# EasyEDA Pro project EasyEda.epro, board Left Hand
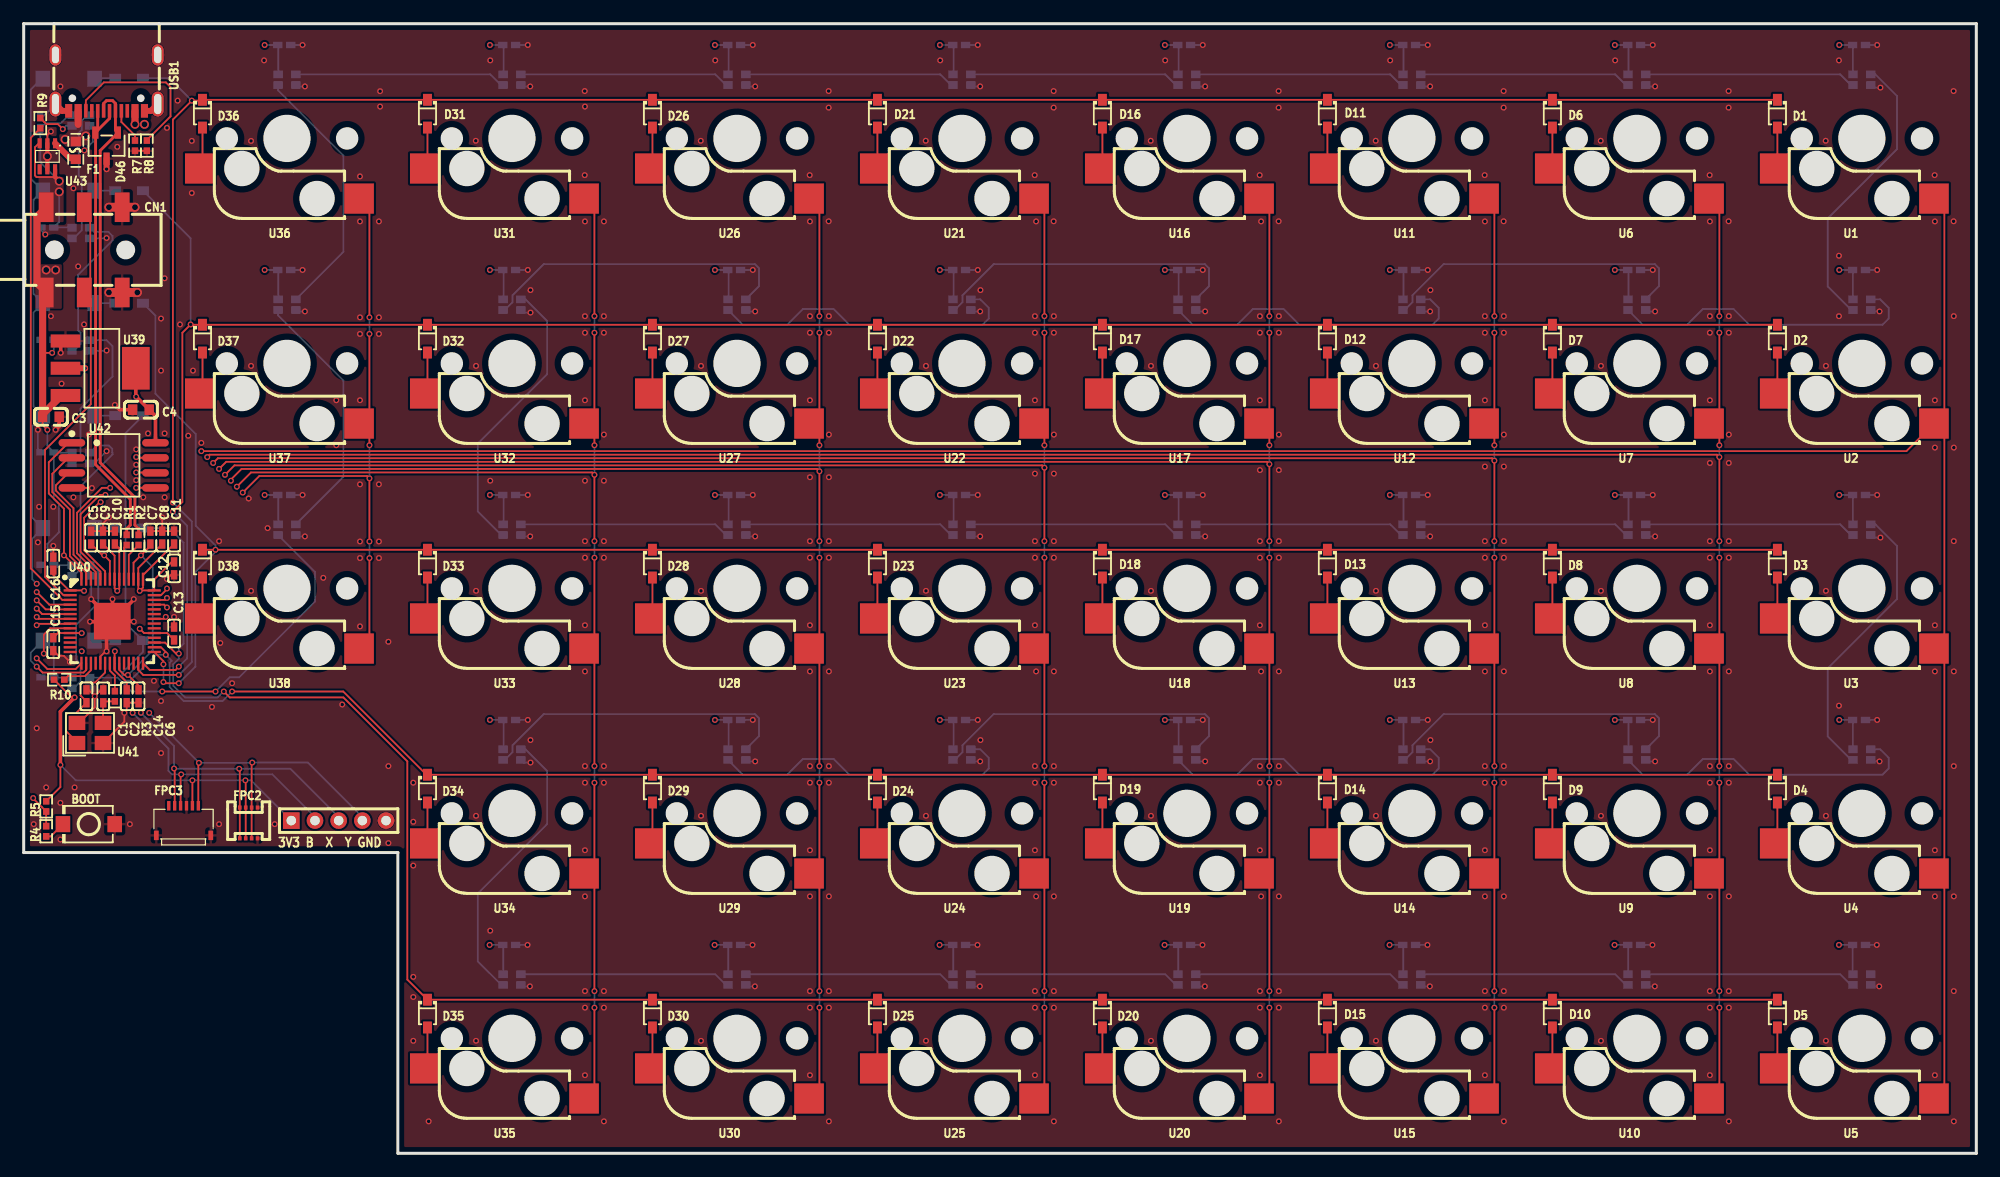
[diagram p5: board, top side]
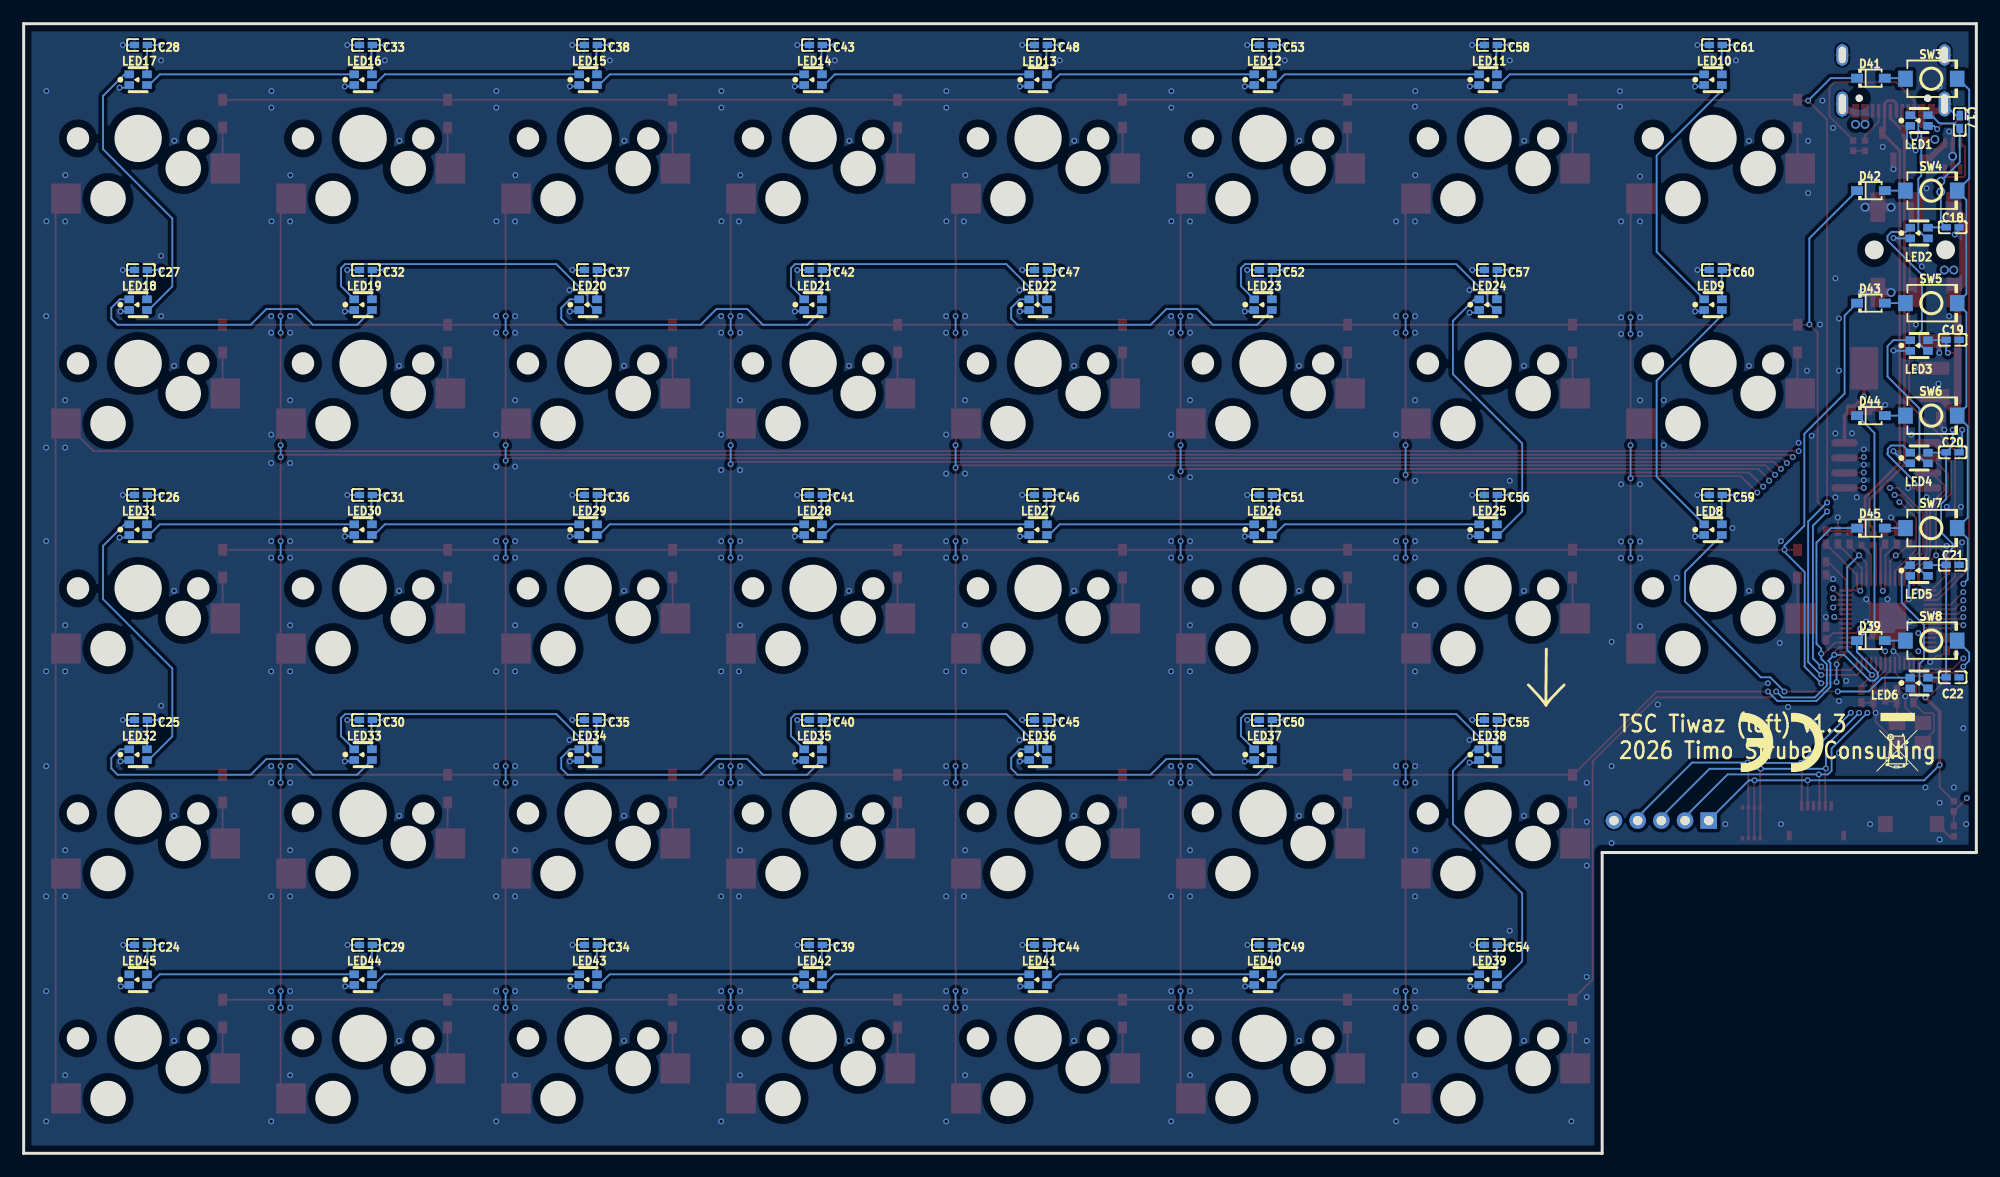
[diagram p6: board, bottom side, seen from below]

Outline 164.9 x 95.4 mm; copper layers: Top Layer, Inner1, Inner2, Bottom Layer. Coordinates in mm from the lower left corner of the outline.
Outline path: 0,95.4 0,25.4 31.6,25.4 31.6,0 164.9,0 164.9,95.4 0,95.4
Stack: Top Layer 0.035mm Outer layer thickness 1oz / Dielectric1 0.2104mm 7628 RC49% 8.6mil / Inner1 0.0152mm Inner layer thickness / Dielectric2 1.065mm 1.1mm H/HOZ Copper / Inner2 0.0152mm Inner layer thickness / Dielectric3 0.2104mm 7628 RC49% 8.6mil / Bottom Layer 0.035mm Outer layer thickness 1oz

## Design rules (mm)
template: User Custom Config
spacing Default (default): track to track 0.15, other pairs 0 to 1
track width Default (default): min 0.15, default 0.15, max 25.4
differential pair differentialPair (default): width min 0.127, default 0.254, max 2.54; gap min 0.152, default 0.152
differential pair USB 12Mbps: width min 0.24, default 0.24, max 0.24; gap min 0.15, default 0.15
via Default (default): diameter min 0.5, default 0.5, max 100.025; hole min 0.3, default 0.3, max 59.995
net $1I33712\VBUS uses Full
pour e92 uses Full
pour e10568 uses Full
pour e31061 uses PWR

## Placement (name value [footprint] x y rotation side)
BOOT  TS-1088-AR02016  [SW-SMD_L3.9-W3.0-P4.45]  5.5 27.8 180 top
C1  15pF  [C0402]  5.3 38.6 90 top
C2  15pF  [C0402]  6.72 38.59 270 top
C3  10uF  [C0603]  2.3 62.2 180 top
C4  10uF  [C0603]  9.9 62.8 0 top
C5  100nF  [C0402]  5.7 52 270 top
C6  100nF  [C0402]  9.7 38.6 90 top
C7  1uF  [C0402]  10.7 52 270 top
C8  1uF  [C0402]  11.7 52 90 top
C9  100nF  [C0402]  6.7 52 270 top
C10  100nF  [C0402]  7.7 52 270 top
C11  100nF  [C0402]  12.7 52 270 top
C12  100nF  [C0402]  12.7 49.4 90 top
C13  100nF  [C0402]  12.7 43.9 270 top
C14  100nF  [C0402]  8.7 38.6 90 top
C15  100nF  [C0402]  2.5 43 90 top
C16  100nF  [C0402]  2.5 49.8 270 top
C17  100nF  [C0402]  1.4 87.1 270 bottom
C18  100nF  [C0402]  2 78.2 0 bottom
C19  100nF  [C0402]  2 68.7 0 bottom
C20  100nF  [C0402]  2 59.2 0 bottom
C21  100nF  [C0402]  2 49.7 0 bottom
C22  100nF  [C0402]  2 40.2 0 bottom
C24  100nF  [C0402]  155 17.6 180 bottom
C25  100nF  [C0402]  155 36.6 180 bottom
C26  100nF  [C0402]  155 55.6 180 bottom
C27  100nF  [C0402]  155 74.6 180 bottom
C28  100nF  [C0402]  155 93.6 180 bottom
C29  100nF  [C0402]  136 17.6 180 bottom
C30  100nF  [C0402]  136 36.6 180 bottom
C31  100nF  [C0402]  136 55.6 180 bottom
C32  100nF  [C0402]  136 74.6 180 bottom
C33  100nF  [C0402]  136 93.6 180 bottom
C34  100nF  [C0402]  117 17.6 180 bottom
C35  100nF  [C0402]  117 36.6 180 bottom
C36  100nF  [C0402]  117 55.6 180 bottom
C37  100nF  [C0402]  117 74.6 180 bottom
C38  100nF  [C0402]  117 93.6 180 bottom
C39  100nF  [C0402]  98 17.6 180 bottom
C40  100nF  [C0402]  98 36.6 180 bottom
C41  100nF  [C0402]  98 55.6 180 bottom
C42  100nF  [C0402]  98 74.6 180 bottom
C43  100nF  [C0402]  98 93.6 180 bottom
C44  100nF  [C0402]  79 17.6 180 bottom
C45  100nF  [C0402]  79 36.6 180 bottom
C46  100nF  [C0402]  79 55.6 180 bottom
C47  100nF  [C0402]  79 74.6 180 bottom
C48  100nF  [C0402]  79 93.6 180 bottom
C49  100nF  [C0402]  60 17.6 180 bottom
C50  100nF  [C0402]  60 36.6 180 bottom
C51  100nF  [C0402]  60 55.6 180 bottom
C52  100nF  [C0402]  60 74.6 180 bottom
C53  100nF  [C0402]  60 93.6 180 bottom
C54  100nF  [C0402]  41 17.6 180 bottom
C55  100nF  [C0402]  41 36.6 180 bottom
C56  100nF  [C0402]  41 55.6 180 bottom
C57  100nF  [C0402]  41 74.6 180 bottom
C58  100nF  [C0402]  41 93.6 180 bottom
C59  100nF  [C0402]  22 55.6 180 bottom
C60  100nF  [C0402]  22 74.6 180 bottom
C61  100nF  [C0402]  22 93.6 180 bottom
CN1  PJ-313D  [AUDIO-SMD_PJ-313D-2]  5.11 76.3 90 top
D1  1N4148WS  [SOD-323_L1.8-W1.3-LS2.5-RD]  148.1 87.8 270 top
D2  1N4148WS  [SOD-323_L1.8-W1.3-LS2.5-RD]  148.1 68.8 270 top
D3  1N4148WS  [SOD-323_L1.8-W1.3-LS2.5-RD]  148.1 49.8 270 top
D4  1N4148WS  [SOD-323_L1.8-W1.3-LS2.5-RD]  148.1 30.8 270 top
D5  1N4148WS  [SOD-323_L1.8-W1.3-LS2.5-RD]  148.1 11.8 270 top
D6  1N4148WS  [SOD-323_L1.8-W1.3-LS2.5-RD]  129.1 87.8 270 top
D7  1N4148WS  [SOD-323_L1.8-W1.3-LS2.5-RD]  129.1 68.8 270 top
D8  1N4148WS  [SOD-323_L1.8-W1.3-LS2.5-RD]  129.1 49.8 270 top
D9  1N4148WS  [SOD-323_L1.8-W1.3-LS2.5-RD]  129.1 30.8 270 top
D10  1N4148WS  [SOD-323_L1.8-W1.3-LS2.5-RD]  129.1 11.8 270 top
D11  1N4148WS  [SOD-323_L1.8-W1.3-LS2.5-RD]  110.1 87.8 270 top
D12  1N4148WS  [SOD-323_L1.8-W1.3-LS2.5-RD]  110.1 68.8 270 top
D13  1N4148WS  [SOD-323_L1.8-W1.3-LS2.5-RD]  110.1 49.8 270 top
D14  1N4148WS  [SOD-323_L1.8-W1.3-LS2.5-RD]  110.1 30.8 270 top
D15  1N4148WS  [SOD-323_L1.8-W1.3-LS2.5-RD]  110.1 11.8 270 top
D16  1N4148WS  [SOD-323_L1.8-W1.3-LS2.5-RD]  91.1 87.8 270 top
D17  1N4148WS  [SOD-323_L1.8-W1.3-LS2.5-RD]  91.1 68.8 270 top
D18  1N4148WS  [SOD-323_L1.8-W1.3-LS2.5-RD]  91.1 49.8 270 top
D19  1N4148WS  [SOD-323_L1.8-W1.3-LS2.5-RD]  91.1 30.8 270 top
D20  1N4148WS  [SOD-323_L1.8-W1.3-LS2.5-RD]  91.1 11.8 270 top
D21  1N4148WS  [SOD-323_L1.8-W1.3-LS2.5-RD]  72.1 87.8 270 top
D22  1N4148WS  [SOD-323_L1.8-W1.3-LS2.5-RD]  72.1 68.8 270 top
D23  1N4148WS  [SOD-323_L1.8-W1.3-LS2.5-RD]  72.1 49.8 270 top
D24  1N4148WS  [SOD-323_L1.8-W1.3-LS2.5-RD]  72.1 30.8 270 top
D25  1N4148WS  [SOD-323_L1.8-W1.3-LS2.5-RD]  72.1 11.8 270 top
D26  1N4148WS  [SOD-323_L1.8-W1.3-LS2.5-RD]  53.1 87.8 270 top
D27  1N4148WS  [SOD-323_L1.8-W1.3-LS2.5-RD]  53.1 68.8 270 top
D28  1N4148WS  [SOD-323_L1.8-W1.3-LS2.5-RD]  53.1 49.8 270 top
D29  1N4148WS  [SOD-323_L1.8-W1.3-LS2.5-RD]  53.1 30.8 270 top
D30  1N4148WS  [SOD-323_L1.8-W1.3-LS2.5-RD]  53.1 11.8 270 top
D31  1N4148WS  [SOD-323_L1.8-W1.3-LS2.5-RD]  34.1 87.8 270 top
D32  1N4148WS  [SOD-323_L1.8-W1.3-LS2.5-RD]  34.1 68.8 270 top
D33  1N4148WS  [SOD-323_L1.8-W1.3-LS2.5-RD]  34.1 49.8 270 top
D34  1N4148WS  [SOD-323_L1.8-W1.3-LS2.5-RD]  34.1 30.8 270 top
D35  1N4148WS  [SOD-323_L1.8-W1.3-LS2.5-RD]  34.1 11.8 270 top
D36  1N4148WS  [SOD-323_L1.8-W1.3-LS2.5-RD]  15.1 87.8 270 top
D37  1N4148WS  [SOD-323_L1.8-W1.3-LS2.5-RD]  15.1 68.8 270 top
D38  1N4148WS  [SOD-323_L1.8-W1.3-LS2.5-RD]  15.1 49.8 270 top
D39  1N4148WS  [SOD-323_L1.8-W1.3-LS2.5-RD]  8.9 43.3 180 bottom
D41  1N4148WS  [SOD-323_L1.8-W1.3-LS2.5-RD]  8.9 90.8 180 bottom
D42  1N4148WS  [SOD-323_L1.8-W1.3-LS2.5-RD]  8.9 81.3 180 bottom
D43  1N4148WS  [SOD-323_L1.8-W1.3-LS2.5-RD]  8.9 71.8 180 bottom
D44  1N4148WS  [SOD-323_L1.8-W1.3-LS2.5-RD]  8.9 62.3 180 bottom
D45  1N4148WS  [SOD-323_L1.8-W1.3-LS2.5-RD]  8.9 52.8 180 bottom
D46  ESDA6V1L  [SOT-23-3_L3.0-W1.7-P0.95-LS2.9-BR]  7 85.1 90 top
F1  BSMD0603-100-6V  [F0603]  4.4 84.7 270 top
FPC2  FA1004SA1-R8000  [CONN-SMD_FA1004SA1-R8000]  19 27.9 0 top
FPC3  FH19C-6S-0.5SH(10)  [FPC-SMD_FH19C-6S-0.5SH]  13.5 28.1 0 top
H1  XY-PZ200V-11-05P  [HDR-TH_XY-PZ200V-11-05P]  26.6 28.1 0 top
LED1  XL-1615RGBC-WS2812B  [LED-SMD_4P-L1.6-W1.5_XL-1615RGBC-WS2812B-1]  4.83 87.22 180 bottom
LED2  XL-1615RGBC-WS2812B  [LED-SMD_4P-L1.6-W1.5_XL-1615RGBC-WS2812B-1]  4.83 77.72 180 bottom
LED3  XL-1615RGBC-WS2812B  [LED-SMD_4P-L1.6-W1.5_XL-1615RGBC-WS2812B-1]  4.83 68.22 180 bottom
LED4  XL-1615RGBC-WS2812B  [LED-SMD_4P-L1.6-W1.5_XL-1615RGBC-WS2812B-1]  4.83 58.72 180 bottom
LED5  XL-1615RGBC-WS2812B  [LED-SMD_4P-L1.6-W1.5_XL-1615RGBC-WS2812B-1]  4.83 49.22 180 bottom
LED6  XL-1615RGBC-WS2812B  [LED-SMD_4P-L1.6-W1.5_XL-1615RGBC-WS2812B-1]  4.83 39.72 180 bottom
LED8  XL-1615RGBC-WS2812B  [LED-SMD_4P-L1.6-W1.5_XL-1615RGBC-WS2812B-1]  22.23 52.67 180 bottom
LED9  XL-1615RGBC-WS2812B  [LED-SMD_4P-L1.6-W1.5_XL-1615RGBC-WS2812B-1]  22.23 71.67 180 bottom
LED10  XL-1615RGBC-WS2812B  [LED-SMD_4P-L1.6-W1.5_XL-1615RGBC-WS2812B-1]  22.23 90.67 180 bottom
LED11  XL-1615RGBC-WS2812B  [LED-SMD_4P-L1.6-W1.5_XL-1615RGBC-WS2812B-1]  41.23 90.67 180 bottom
LED12  XL-1615RGBC-WS2812B  [LED-SMD_4P-L1.6-W1.5_XL-1615RGBC-WS2812B-1]  60.24 90.67 180 bottom
LED13  XL-1615RGBC-WS2812B  [LED-SMD_4P-L1.6-W1.5_XL-1615RGBC-WS2812B-1]  79.24 90.67 180 bottom
LED14  XL-1615RGBC-WS2812B  [LED-SMD_4P-L1.6-W1.5_XL-1615RGBC-WS2812B-1]  98.24 90.67 180 bottom
LED15  XL-1615RGBC-WS2812B  [LED-SMD_4P-L1.6-W1.5_XL-1615RGBC-WS2812B-1]  117.24 90.67 180 bottom
LED16  XL-1615RGBC-WS2812B  [LED-SMD_4P-L1.6-W1.5_XL-1615RGBC-WS2812B-1]  136.24 90.67 180 bottom
LED17  XL-1615RGBC-WS2812B  [LED-SMD_4P-L1.6-W1.5_XL-1615RGBC-WS2812B-1]  155.24 90.67 180 bottom
LED18  XL-1615RGBC-WS2812B  [LED-SMD_4P-L1.6-W1.5_XL-1615RGBC-WS2812B-1]  155.24 71.67 180 bottom
LED19  XL-1615RGBC-WS2812B  [LED-SMD_4P-L1.6-W1.5_XL-1615RGBC-WS2812B-1]  136.24 71.67 180 bottom
LED20  XL-1615RGBC-WS2812B  [LED-SMD_4P-L1.6-W1.5_XL-1615RGBC-WS2812B-1]  117.24 71.67 180 bottom
LED21  XL-1615RGBC-WS2812B  [LED-SMD_4P-L1.6-W1.5_XL-1615RGBC-WS2812B-1]  98.24 71.67 180 bottom
LED22  XL-1615RGBC-WS2812B  [LED-SMD_4P-L1.6-W1.5_XL-1615RGBC-WS2812B-1]  79.24 71.67 180 bottom
LED23  XL-1615RGBC-WS2812B  [LED-SMD_4P-L1.6-W1.5_XL-1615RGBC-WS2812B-1]  60.24 71.67 180 bottom
LED24  XL-1615RGBC-WS2812B  [LED-SMD_4P-L1.6-W1.5_XL-1615RGBC-WS2812B-1]  41.23 71.67 180 bottom
LED25  XL-1615RGBC-WS2812B  [LED-SMD_4P-L1.6-W1.5_XL-1615RGBC-WS2812B-1]  41.23 52.67 180 bottom
LED26  XL-1615RGBC-WS2812B  [LED-SMD_4P-L1.6-W1.5_XL-1615RGBC-WS2812B-1]  60.24 52.67 180 bottom
LED27  XL-1615RGBC-WS2812B  [LED-SMD_4P-L1.6-W1.5_XL-1615RGBC-WS2812B-1]  79.24 52.67 180 bottom
LED28  XL-1615RGBC-WS2812B  [LED-SMD_4P-L1.6-W1.5_XL-1615RGBC-WS2812B-1]  98.24 52.67 180 bottom
LED29  XL-1615RGBC-WS2812B  [LED-SMD_4P-L1.6-W1.5_XL-1615RGBC-WS2812B-1]  117.24 52.67 180 bottom
LED30  XL-1615RGBC-WS2812B  [LED-SMD_4P-L1.6-W1.5_XL-1615RGBC-WS2812B-1]  136.24 52.67 180 bottom
LED31  XL-1615RGBC-WS2812B  [LED-SMD_4P-L1.6-W1.5_XL-1615RGBC-WS2812B-1]  155.24 52.67 180 bottom
LED32  XL-1615RGBC-WS2812B  [LED-SMD_4P-L1.6-W1.5_XL-1615RGBC-WS2812B-1]  155.24 33.67 180 bottom
LED33  XL-1615RGBC-WS2812B  [LED-SMD_4P-L1.6-W1.5_XL-1615RGBC-WS2812B-1]  136.24 33.67 180 bottom
LED34  XL-1615RGBC-WS2812B  [LED-SMD_4P-L1.6-W1.5_XL-1615RGBC-WS2812B-1]  117.24 33.67 180 bottom
LED35  XL-1615RGBC-WS2812B  [LED-SMD_4P-L1.6-W1.5_XL-1615RGBC-WS2812B-1]  98.24 33.67 180 bottom
LED36  XL-1615RGBC-WS2812B  [LED-SMD_4P-L1.6-W1.5_XL-1615RGBC-WS2812B-1]  79.24 33.67 180 bottom
LED37  XL-1615RGBC-WS2812B  [LED-SMD_4P-L1.6-W1.5_XL-1615RGBC-WS2812B-1]  60.24 33.67 180 bottom
LED38  XL-1615RGBC-WS2812B  [LED-SMD_4P-L1.6-W1.5_XL-1615RGBC-WS2812B-1]  41.23 33.67 180 bottom
LED39  XL-1615RGBC-WS2812B  [LED-SMD_4P-L1.6-W1.5_XL-1615RGBC-WS2812B-1]  41.23 14.67 180 bottom
LED40  XL-1615RGBC-WS2812B  [LED-SMD_4P-L1.6-W1.5_XL-1615RGBC-WS2812B-1]  60.24 14.67 180 bottom
LED41  XL-1615RGBC-WS2812B  [LED-SMD_4P-L1.6-W1.5_XL-1615RGBC-WS2812B-1]  79.24 14.67 180 bottom
LED42  XL-1615RGBC-WS2812B  [LED-SMD_4P-L1.6-W1.5_XL-1615RGBC-WS2812B-1]  98.24 14.67 180 bottom
LED43  XL-1615RGBC-WS2812B  [LED-SMD_4P-L1.6-W1.5_XL-1615RGBC-WS2812B-1]  117.24 14.67 180 bottom
LED44  XL-1615RGBC-WS2812B  [LED-SMD_4P-L1.6-W1.5_XL-1615RGBC-WS2812B-1]  136.24 14.67 180 bottom
LED45  XL-1615RGBC-WS2812B  [LED-SMD_4P-L1.6-W1.5_XL-1615RGBC-WS2812B-1]  155.24 14.67 180 bottom
R1  22Ω  [R0402]  8.7 51.8 270 top
R2  22Ω  [R0402]  9.7 51.8 270 top
R3  1kΩ  [R0402]  7.7 38.6 270 top
R4  1kΩ  [R0402]  1.9 27.2 270 top
R5  10kΩ  [R0402]  1.9 29.3 90 top
R7  5.1kΩ  [R0402]  9.4 85.1 90 top
R8  5.1kΩ  [R0402]  10.4 85.1 90 top
R9  330Ω  [R0402]  1.4 87 270 top
R10  10kΩ  [R0402]  3 40 180 top
SW3  TS-1088-AR02016  [SW-SMD_L3.9-W3.0-P4.45]  3.8 90.75 180 bottom
SW4  TS-1088-AR02016  [SW-SMD_L3.9-W3.0-P4.45]  3.8 81.3 180 bottom
SW5  TS-1088-AR02016  [SW-SMD_L3.9-W3.0-P4.45]  3.8 71.8 180 bottom
SW6  TS-1088-AR02016  [SW-SMD_L3.9-W3.0-P4.45]  3.8 62.3 180 bottom
SW7  TS-1088-AR02016  [SW-SMD_L3.9-W3.0-P4.45]  3.8 52.8 180 bottom
SW8  TS-1088-AR02016  [SW-SMD_L3.9-W3.0-P4.45]  3.8 43.3 180 bottom
U1  CPG151101S11-16  [SMD_KEYBOARD-SW_COMPLETE]  154.6 81.9 0 top
U2  CPG151101S11-16  [SMD_KEYBOARD-SW_COMPLETE]  154.6 62.9 0 top
U3  CPG151101S11-16  [SMD_KEYBOARD-SW_COMPLETE]  154.6 43.9 0 top
U4  CPG151101S11-16  [SMD_KEYBOARD-SW_COMPLETE]  154.6 24.9 0 top
U5  CPG151101S11-16  [SMD_KEYBOARD-SW_COMPLETE]  154.6 5.9 0 top
U6  CPG151101S11-16  [SMD_KEYBOARD-SW_COMPLETE]  135.6 81.9 0 top
U7  CPG151101S11-16  [SMD_KEYBOARD-SW_COMPLETE]  135.6 62.9 0 top
U8  CPG151101S11-16  [SMD_KEYBOARD-SW_COMPLETE]  135.6 43.9 0 top
U9  CPG151101S11-16  [SMD_KEYBOARD-SW_COMPLETE]  135.6 24.9 0 top
U10  CPG151101S11-16  [SMD_KEYBOARD-SW_COMPLETE]  135.6 5.9 0 top
U11  CPG151101S11-16  [SMD_KEYBOARD-SW_COMPLETE]  116.6 81.9 0 top
U12  CPG151101S11-16  [SMD_KEYBOARD-SW_COMPLETE]  116.6 62.9 0 top
U13  CPG151101S11-16  [SMD_KEYBOARD-SW_COMPLETE]  116.6 43.9 0 top
U14  CPG151101S11-16  [SMD_KEYBOARD-SW_COMPLETE]  116.6 24.9 0 top
U15  CPG151101S11-16  [SMD_KEYBOARD-SW_COMPLETE]  116.6 5.9 0 top
U16  CPG151101S11-16  [SMD_KEYBOARD-SW_COMPLETE]  97.6 81.9 0 top
U17  CPG151101S11-16  [SMD_KEYBOARD-SW_COMPLETE]  97.6 62.9 0 top
U18  CPG151101S11-16  [SMD_KEYBOARD-SW_COMPLETE]  97.6 43.9 0 top
U19  CPG151101S11-16  [SMD_KEYBOARD-SW_COMPLETE]  97.6 24.9 0 top
U20  CPG151101S11-16  [SMD_KEYBOARD-SW_COMPLETE]  97.6 5.9 0 top
U21  CPG151101S11-16  [SMD_KEYBOARD-SW_COMPLETE]  78.6 81.9 0 top
U22  CPG151101S11-16  [SMD_KEYBOARD-SW_COMPLETE]  78.6 62.9 0 top
U23  CPG151101S11-16  [SMD_KEYBOARD-SW_COMPLETE]  78.6 43.9 0 top
U24  CPG151101S11-16  [SMD_KEYBOARD-SW_COMPLETE]  78.6 24.9 0 top
U25  CPG151101S11-16  [SMD_KEYBOARD-SW_COMPLETE]  78.6 5.9 0 top
U26  CPG151101S11-16  [SMD_KEYBOARD-SW_COMPLETE]  59.6 81.9 0 top
U27  CPG151101S11-16  [SMD_KEYBOARD-SW_COMPLETE]  59.6 62.9 0 top
U28  CPG151101S11-16  [SMD_KEYBOARD-SW_COMPLETE]  59.6 43.9 0 top
U29  CPG151101S11-16  [SMD_KEYBOARD-SW_COMPLETE]  59.6 24.9 0 top
U30  CPG151101S11-16  [SMD_KEYBOARD-SW_COMPLETE]  59.6 5.9 0 top
U31  CPG151101S11-16  [SMD_KEYBOARD-SW_COMPLETE]  40.6 81.9 0 top
U32  CPG151101S11-16  [SMD_KEYBOARD-SW_COMPLETE]  40.6 62.9 0 top
U33  CPG151101S11-16  [SMD_KEYBOARD-SW_COMPLETE]  40.6 43.9 0 top
U34  CPG151101S11-16  [SMD_KEYBOARD-SW_COMPLETE]  40.6 24.9 0 top
U35  CPG151101S11-16  [SMD_KEYBOARD-SW_COMPLETE]  40.6 5.9 0 top
U36  CPG151101S11-16  [SMD_KEYBOARD-SW_COMPLETE]  21.6 81.9 0 top
U37  CPG151101S11-16  [SMD_KEYBOARD-SW_COMPLETE]  21.6 62.9 0 top
U38  CPG151101S11-16  [SMD_KEYBOARD-SW_COMPLETE]  21.6 43.9 0 top
U39  AMS1117-3.3  [SOT-223-3_L6.5-W3.4-P2.30-LS7.0-BR]  6.5 66.3 180 top
U40  RP2040  [LQFN-56_L7.0-W7.0-P0.4-EP]  7.48 44.94 0 top
U41  ABM8-272-T3  [CRYSTAL-SMD_4P-L3.2-W2.5-BL]  5.6 35.5 0 top
U42  W25Q16JVSSIQ  [SOIC-8_L5.3-W5.3-P1.27-LS8.0-BL]  7.6 58.1 270 top
U43  LM66100DCKR  [SC-70-6_L2.0-W1.3-P0.65-LS2.1-BL]  2 84.2 180 top
USB1  TYPE-C16PIN  [USB-C-SMD_TYPE-C16PIN]  7 90.4 180 top

## Footprints (pads in the part's own frame, mm; a bottom-side part is the same pattern mirrored in y, then rotated)
AUDIO-SMD_PJ-313D-2
  rect 2.5x1.25 smd: 1(-3.6,3.205) 1(3.6,3.205) 2(-3.6,-0.005) 2(3.6,-0.005) 3(-3.6,-3.205) 3(3.6,-3.205)
C0402
  rect 0.79x0.54 smd: 1(-0.545,0) 2(0.545,0)
C0603
  rect 0.8x0.9 smd: 1(-0.7,0) 2(0.7,0)
CONN-SMD_FA1004SA1-R8000
  rect 0.3x0.35 smd: 1(-0.75,-1.3) 2(-0.25,-1.3) 3(0.25,-1.3) 4(0.75,-1.3) 5(-0.75,1.3) 6(-0.25,1.3) 7(0.25,1.3) 8(0.75,1.3)
CRYSTAL-SMD_4P-L3.2-W2.5-BL
  rect 1.4x1.2 smd: 1(-1.1,-0.85) 2(1.1,-0.85) 3(1.1,0.85) 4(-1.1,0.85)
F0603
  rect 0.806x0.864 smd: 1(-0.753,0) 2(0.753,0)
FPC-SMD_FH19C-6S-0.5SH
  rect 0.28x0.8 smd: 1(-1.25,1.25) 2(-0.75,1.25) 3(-0.25,1.25) 4(0.25,1.25) 5(0.75,1.25) 6(1.25,1.25)
  rect 0.4x0.8 smd: 7(2.3,-1.25) 8(-2.3,-1.25)
HDR-TH_XY-PZ200V-11-05P
  rect 1.4x1.4 hole 0.8: 1(-4,0)
  round 1.4 hole 0.8: 2(-2,0) 3(0,0) 4(2,0) 5(4,0)
LED-SMD_4P-L1.6-W1.5_XL-1615RGBC-WS2812B-1
  rect 0.8x0.65 smd: 1(-0.75,-0.45) 2(0.75,-0.45) 3(0.75,0.45) 4(-0.75,0.45)
LQFN-56_L7.0-W7.0-P0.4-EP
  rect 1.1x0.2 smd: 1(-3.55,2.6) 2(-3.55,2.2) 3(-3.55,1.8) 4(-3.55,1.4) 5(-3.55,1) 6(-3.55,0.6) 7(-3.55,0.2) 8(-3.55,-0.2) 9(-3.55,-0.6) 10(-3.55,-1) 11(-3.55,-1.4) 12(-3.55,-1.8) 13(-3.55,-2.2) 14(-3.55,-2.6) 29(3.55,-2.6) 30(3.55,-2.2) 31(3.55,-1.8) 32(3.55,-1.4) 33(3.55,-1) 34(3.55,-0.6) 35(3.55,-0.2) 36(3.55,0.2) 37(3.55,0.6) 38(3.55,1) 39(3.55,1.4) 40(3.55,1.8) 41(3.55,2.2) 42(3.55,2.6)
  rect 0.2x1.1 smd: 15(-2.6,-3.55) 16(-2.2,-3.55) 17(-1.8,-3.55) 18(-1.4,-3.55) 19(-1,-3.55) 20(-0.6,-3.55) 21(-0.2,-3.55) 22(0.2,-3.55) 23(0.6,-3.55) 24(1,-3.55) 25(1.4,-3.55) 26(1.8,-3.55) 27(2.2,-3.55) 28(2.6,-3.55) 43(2.6,3.55) 44(2.2,3.55) 45(1.8,3.55) 46(1.4,3.55) 47(1,3.55) 48(0.6,3.55) 49(0.2,3.55) 50(-0.2,3.55) 51(-0.6,3.55) 52(-1,3.55) 53(-1.4,3.55) 54(-1.8,3.55) 55(-2.2,3.55) 56(-2.6,3.55)
  rect 3.1x3.1 smd: 57(0,0)
R0402
  rect 0.566x0.54 smd: 1(-0.433,0) 2(0.433,0)
SC-70-6_L2.0-W1.3-P0.65-LS2.1-BL
  rect 0.35x0.85 smd: 1(-0.65,-1.1) 2(0,-1.1) 3(0.65,-1.1) 4(0.65,1.1) 5(0,1.1) 6(-0.65,1.1)
SMD_KEYBOARD-SW_COMPLETE
  rect 2.5x2.55 smd: 1(-6.725,1.27) 2(6.725,-1.27)
SOD-323_L1.8-W1.3-LS2.5-RD
  rect 1x0.75 smd: 1(-1.173,0) 2(1.173,0)
SOIC-8_L5.3-W5.3-P1.27-LS8.0-BL
  oval 0.63x2.25 smd: 1(-1.905,-3.53) 2(-0.635,-3.53) 3(0.635,-3.53) 4(1.905,-3.53) 5(1.905,3.53) 6(0.635,3.53) 7(-0.635,3.53) 8(-1.905,3.53)
SOT-23-3_L3.0-W1.7-P0.95-LS2.9-BR
  rect 1.038x0.532 smd: 1(1.101,-0.95) 2(1.101,0.95) 3(-1.101,0)
SOT-223-3_L6.5-W3.4-P2.30-LS7.0-BR
  rect 2.5x1.1 smd: 1(2.97,-2.3) 2(2.97,0) 3(2.97,2.3)
  rect 2.34x3.6 smd: 4(-2.97,0)
SW-SMD_L3.9-W3.0-P4.45
  rect 1.23x1.36 smd: 1(-2.185,0) 2(2.185,0)
USB-C-SMD_TYPE-C16PIN
  oval 1x2.1 hole 0.6x1.7: 1(-4.32,1.788) 2(4.32,1.788)
  oval 1x1.8 hole 0.6x1.4: 3(-4.32,-2.362) 4(4.32,-2.362)
  rect 0.6x1.15 smd: A1B12(-3.2,2.362) A4B9(-2.4,2.362) B1A12(3.2,2.362) B4A9(2.4,2.362)
  rect 0.3x1.15 smd: A5(-1.25,2.362) A6(-0.25,2.362) A7(0.25,2.362) A8(1.25,2.362) B5(1.75,2.362) B6(0.75,2.362) B7(-0.75,2.362) B8(-1.75,2.362)

## Nets
$1I33712\1V1: C5.2 C6.2 C7.2 U40.23 U40.45 U40.50
$1I33712\5V: C3.2 C17.2 C18.2 C19.2 C20.2 C21.2 C22.2 C24.2 C25.2 C26.2 C27.2 C28.2 C29.2 C30.2 C31.2 C32.2 C33.2 C34.2 C35.2 C36.2 C37.2 C38.2 C39.2 C40.2 C41.2 C42.2 C43.2 C44.2 C45.2 C46.2 C47.2 C48.2 C49.2 C50.2 C51.2 C52.2 C53.2 C54.2 C55.2 C56.2 C57.2 C58.2 C59.2 C60.2 C61.2 CN1.1 LED1.3 LED2.3 LED3.3 LED4.3 LED5.3 LED6.3 LED8.3 LED9.3 LED10.3 LED11.3 LED12.3 LED13.3 LED14.3 LED15.3 LED16.3 LED17.3 LED18.3 LED19.3 LED20.3 LED21.3 LED22.3 LED23.3 LED24.3 LED25.3 LED26.3 LED27.3 LED28.3 LED29.3 LED30.3 LED31.3 LED32.3 LED33.3 LED34.3 LED35.3 LED36.3 LED37.3 LED38.3 LED39.3 LED40.3 LED41.3 LED42.3 LED43.3 LED44.3 LED45.3 U39.3 U43.3 U43.6
$1I33712\$1N1: R1.2 U40.47
$1I33712\$1N6: C2.2 R3.2 U41.3
$1I33712\$1N17: R7.2 USB1.A5
$1I33712\$1N18: R8.2 USB1.B5
$1I33712\$1N2773: R2.2 U40.46
$1I33712\$1N2838: BOOT.2 R4.2
$1I33712\$1N29010: F1.2 U43.1
$1I33712\$6N6477: LED2.4 LED3.2
$1I33712\$6N6478: LED3.4 LED4.2
$1I33712\$6N6479: LED1.4 LED2.2
$1I33712\$6N6480: LED4.4 LED5.2
$1I33712\$6N6482: LED8.4 LED9.2
$1I33712\$6N6483: LED6.4 LED8.2
$1I33712\$6N6484: LED9.4 LED10.2
$1I33712\$6N6485: LED12.4 LED13.2
$1I33712\$6N6486: LED22.4 LED23.2
$1I33712\$6N6487: LED23.4 LED24.2
$1I33712\$6N6488: LED21.4 LED22.2
$1I33712\$6N6489: LED24.4 LED25.2
$1I33712\$6N6490: LED27.4 LED28.2
$1I33712\$6N6491: LED28.4 LED29.2
$1I33712\$6N6492: LED26.4 LED27.2
$1I33712\$6N6493: LED29.4 LED30.2
$1I33712\$6N6494: LED32.4 LED33.2
$1I33712\$6N6495: LED33.4 LED34.2
$1I33712\$6N6496: LED31.4 LED32.2
$1I33712\$6N6497: LED34.4 LED35.2
$1I33712\$6N6498: LED37.4 LED38.2
$1I33712\$6N6499: LED38.4 LED39.2
$1I33712\$6N6500: LED36.4 LED37.2
$1I33712\$6N6501: LED39.4 LED40.2
$1I33712\$6N6502: LED42.4 LED43.2
$1I33712\$6N6503: LED43.4 LED44.2
$1I33712\$6N6504: LED41.4 LED42.2
$1I33712\$6N6505: LED44.4 LED45.2
$1I33712\$6N6506: LED18.4 LED19.2
$1I33712\$6N6507: LED11.4 LED12.2
$1I33712\$6N6508: LED14.4 LED15.2
$1I33712\$6N6509: LED13.4 LED14.2
$1I33712\$6N6510: LED19.4 LED20.2
$1I33712\$6N6511: LED17.4 LED18.2
$1I33712\$6N6512: LED16.4 LED17.2
$1I33712\$6N6513: LED1.2 R9.1
$1I33712\$6N6516: LED5.4 LED6.2
$1I33712\$6N6517: LED10.4 LED11.2
$1I33712\$6N6518: LED15.4 LED16.2
$1I33712\$6N6519: LED20.4 LED21.2
$1I33712\$6N6520: LED25.4 LED26.2
$1I33712\$6N6521: LED30.4 LED31.2
$1I33712\$6N6522: LED35.4 LED36.2
$1I33712\$6N6523: LED40.4 LED41.2
$1I33712\$7N3321: D1.2 U1.1
$1I33712\$7N3322: D3.2 U3.1
$1I33712\$7N3323: D4.2 U4.1
$1I33712\$7N3324: D5.2 U5.1
$1I33712\$7N3325: D6.2 U6.1
$1I33712\$7N3326: D7.2 U7.1
$1I33712\$7N3327: D8.2 U8.1
$1I33712\$7N3328: D9.2 U9.1
$1I33712\$7N3329: D10.2 U10.1
$1I33712\$7N3330: D11.2 U11.1
$1I33712\$7N3331: D12.2 U12.1
$1I33712\$7N3332: D13.2 U13.1
$1I33712\$7N3333: D14.2 U14.1
$1I33712\$7N3334: D15.2 U15.1
$1I33712\$7N3335: D16.2 U16.1
$1I33712\$7N3336: D17.2 U17.1
$1I33712\$7N3337: D18.2 U18.1
$1I33712\$7N3338: D19.2 U19.1
$1I33712\$7N3339: D20.2 U20.1
$1I33712\$7N3340: D21.2 U21.1
$1I33712\$7N3341: D22.2 U22.1
$1I33712\$7N3342: D23.2 U23.1
$1I33712\$7N3343: D24.2 U24.1
$1I33712\$7N3344: D25.2 U25.1
$1I33712\$7N3345: D26.2 U26.1
$1I33712\$7N3346: D27.2 U27.1
$1I33712\$7N3347: D28.2 U28.1
$1I33712\$7N3348: D29.2 U29.1
$1I33712\$7N3349: D30.2 U30.1
$1I33712\$7N3350: D31.2 U31.1
$1I33712\$7N3351: D32.2 U32.1
$1I33712\$7N3352: D33.2 U33.1
$1I33712\$7N3353: D34.2 U34.1
$1I33712\$7N3354: D35.2 U35.1
$1I33712\$7N3355: D36.2 U36.1
$1I33712\$7N3356: D37.2 U37.1
$1I33712\$7N3357: D38.2 U38.1
$1I33712\$7N3358: D39.2 SW8.1
$1I33712\$7N3359: D41.2 SW3.1
$1I33712\$7N3360: D42.2 SW4.1
$1I33712\$7N3361: D43.2 SW5.1
$1I33712\$7N3362: D44.2 SW6.1
$1I33712\$7N3363: D45.2 SW7.1
$1I33712\$7N3393: D2.2 U2.1
$1I33712\COL1: U1.2 U2.2 U3.2 U4.2 U5.2 U40.4
$1I33712\COL2: U6.2 U7.2 U8.2 U9.2 U10.2 U40.5
$1I33712\COL3: U11.2 U12.2 U13.2 U14.2 U15.2 U40.6
$1I33712\COL4: U16.2 U17.2 U18.2 U19.2 U20.2 U40.7
$1I33712\COL5: U21.2 U22.2 U23.2 U24.2 U25.2 U40.8
$1I33712\COL6: U26.2 U27.2 U28.2 U29.2 U30.2 U40.9
$1I33712\COL7: U31.2 U32.2 U33.2 U34.2 U35.2 U40.15
$1I33712\COL8: SW8.2 U36.2 U37.2 U38.2 U40.16
$1I33712\COL9: SW3.2 SW4.2 SW5.2 SW6.2 SW7.2 U40.36
$1I33712\DI: R9.2 U40.3
$1I33712\GND: BOOT.1 C1.2 C2.1 C3.1 C4.1 C5.1 C6.1 C7.1 C8.2 C9.1 C10.1 C11.1 C12.1 C13.1 C14.1 C15.1 C16.1 C17.1 C18.1 C19.1 C20.1 C21.1 C22.1 C24.1 C25.1 C26.1 C27.1 C28.1 C29.1 C30.1 C31.1 C32.1 C33.1 C34.1 C35.1 C36.1 C37.1 C38.1 C39.1 C40.1 C41.1 C42.1 C43.1 C44.1 C45.1 C46.1 C47.1 C48.1 C49.1 C50.1 C51.1 C52.1 C53.1 C54.1 C55.1 C56.1 C57.1 C58.1 C59.1 C60.1 C61.1 CN1.3 D46.3 FPC2.4 FPC2.8 FPC3.4 FPC3.7 FPC3.8 H1.5 LED1.1 LED2.1 LED3.1 LED4.1 LED5.1 LED6.1 LED8.1 LED9.1 LED10.1 LED11.1 LED12.1 LED13.1 LED14.1 LED15.1 LED16.1 LED17.1 LED18.1 LED19.1 LED20.1 LED21.1 LED22.1 LED23.1 LED24.1 LED25.1 LED26.1 LED27.1 LED28.1 LED29.1 LED30.1 LED31.1 LED32.1 LED33.1 LED34.1 LED35.1 LED36.1 LED37.1 LED38.1 LED39.1 LED40.1 LED41.1 LED42.1 LED43.1 LED44.1 LED45.1 R7.1 R8.1 U39.1 U40.19 U40.57 U41.2 U41.4 U42.4 U43.2 U43.5 USB1.1 USB1.2 USB1.3 USB1.4 USB1.A1B12 USB1.B1A12
$1I33712\JOY_B: FPC3.3 H1.2 U40.41
$1I33712\JOY_X: FPC2.1 FPC2.5 FPC3.2 H1.3 U40.40
$1I33712\JOY_Y: FPC2.3 FPC2.7 FPC3.6 H1.4 U40.39
$1I33712\QSPI_CLK: U40.52 U42.6
$1I33712\QSPI_CS: R4.1 R5.1 U40.56 U42.1
$1I33712\QSPI_IO0: U40.53 U42.5
$1I33712\QSPI_IO1: U40.55 U42.2
$1I33712\QSPI_IO2: U40.54 U42.3
$1I33712\QSPI_IO3: U40.51 U42.7
$1I33712\ROW1: D1.1 D6.1 D11.1 D16.1 D21.1 D26.1 D31.1 D36.1 D41.1 U40.27
$1I33712\ROW2: D2.1 D7.1 D12.1 D17.1 D22.1 D27.1 D32.1 D37.1 D42.1 U40.28
$1I33712\ROW3: D3.1 D8.1 D13.1 D18.1 D23.1 D28.1 D33.1 D38.1 D43.1 U40.29
$1I33712\ROW4: D4.1 D9.1 D14.1 D19.1 D24.1 D29.1 D34.1 D39.1 D44.1 U40.30
$1I33712\ROW5: D5.1 D10.1 D15.1 D20.1 D25.1 D30.1 D35.1 D45.1 U40.31
$1I33712\RUN: U40.26
$1I33712\SERIAL: CN1.2 U40.2
$1I33712\USB_D+: D46.2 R1.1 USB1.A6 USB1.B6
$1I33712\USB_D-: D46.1 R2.1 USB1.A7 USB1.B7
$1I33712\VBUS: F1.1 USB1.A4B9 USB1.B4A9
$1I33712\XIN: C1.1 U40.20 U41.1
$1I33712\XOUT: R3.1 U40.21
$1N33911: C4.2 C8.1 C9.2 C10.2 C11.2 C12.2 C13.2 C14.2 C15.2 C16.2 FPC2.2 FPC2.6 FPC3.5 H1.1 R5.2 R10.2 U39.2 U39.4 U40.1 U40.10 U40.22 U40.33 U40.42 U40.43 U40.44 U40.48 U40.49 U42.8
$1N33915: R10.1 U40.17

Pads without a net: FPC3 1; LED45 4; U40 11 12 13 14 18 24 25 32 34 35 37 38; U43 4; USB1 A8 B8

## Via types
v1: diameter 0.5, hole 0.299, Top Layer to Bottom Layer, 494 vias
v2: diameter 0.5, hole 0.3, Top Layer to Bottom Layer, 136 vias
v3: diameter 0.75, hole 0.5, Top Layer to Bottom Layer, 13 vias

## Routing (per net, layer and track width the routed paths; a pad name or vN(x,y) marks a point on that pad's centre or on a via; arc(x,y) is an arc through that point)
$1I33712\1V1: length 24.8
  Top Layer w0.15: U40.23 8.08,40.82 8.5,40.4 v2(8.8,40.4) 9.7,39.5 C6.2 ; 10.7,51.46 10.7,51.3 v1(9.9,50.5) 9.28,49.88 U40.45 ; U40.50 7.28,50.02 v1(6.8,50.5) 6.66,50.5 5.7,51.46
  Inner2 w0.2: v1(9.9,50.5) v1(6.8,50.5)
  Bottom Layer w0.15: v2(8.8,40.4) 10.9,42.5 10.9,49.5 v1(9.9,50.5)
$1I33712\5V: length 209.6
  Top Layer w0.15: C3.2 1.6,61.5 v2(2,61.1) ; 1.6,67.62 1.62,67.6 v2(2.4,67.6) ; 2.65,82.45 1.08,82.45 0.95,82.58 0.95,84.97 1.28,85.3
  Top Layer w0.35: U43.6 2.65,82.45 v3(3,82.1)
  Top Layer w0.6: U39.3 3.2,64 1.6,62.4 1.6,72.4 CN1.1 1.12,73.48 1.12,79.12 CN1.1
  Bottom Layer w0.15: v1(153.3,17.6) C24.2 154.46,15.15 LED45.3 ; LED2.3 4.05,78.2 C18.2 3,78.66 v3(3,81.2) ; LED5.3 2.58,49.67 C21.2 ; LED6.3 2.58,40.17 C22.2 C21.2 ; v1(77.35,17.6) 78.5,17.6 78.5,15.15 78.53,15.12 ; 78.56,34.12 78.53,34.15 78.53,36.6 v1(77.38,36.6) ; C21.2 2.55,50.58 2,51.13 2,51.47 2.97,52.45 2.97,54.83 2.55,55.26 C20.2 ; C20.2 2,59.75 v2(2,61.1) ; C20.2 2.58,59.17 LED4.3 ; v1(134.38,74.6) 135.53,74.6 135.53,72.15 135.56,72.12 ; v1(39.38,93.6) 40.53,93.6 40.53,91.15 40.56,91.12 ; 21.53,53.12 21.5,53.15 21.5,55.6 v1(20.35,55.6) ; 40.56,53.12 40.53,53.15 40.53,55.6 v1(39.38,55.6) ; 40.56,72.12 40.53,72.15 40.53,74.6 v1(39.38,74.6) ; v1(96.35,17.6) 97.5,17.6 97.5,15.15 97.53,15.12 ; v1(115.38,36.6) 116.53,36.6 116.53,34.15 116.56,34.12 ; 97.56,91.12 97.53,91.15 97.53,93.6 v1(96.38,93.6) ; v1(39.38,36.6) 40.53,36.6 40.53,34.15 40.56,34.12 ; 154.51,34.12 154.48,34.15 154.48,36.6 v1(153.32,36.6) ; v1(39.35,17.6) 40.5,17.6 40.5,15.15 40.53,15.12 ; 154.51,53.12 154.48,53.15 154.48,55.6 v1(153.32,55.6) ; v1(115.38,74.6) 116.53,74.6 116.53,72.15 116.56,72.12 ; 154.51,72.12 154.48,72.15 154.48,74.6 v1(153.32,74.6) ; 59.56,53.12 59.53,53.15 59.53,55.6 v1(58.38,55.6) ; v1(58.38,93.6) 59.53,93.6 59.53,91.15 59.56,91.12 ; v1(58.35,17.6) 59.5,17.6 59.5,15.15 59.53,15.12 ; v1(96.38,55.6) 97.53,55.6 97.53,53.15 97.56,53.12 ; 97.56,72.12 97.53,72.15 97.53,74.6 v1(96.38,74.6) ; 154.51,91.12 154.48,91.15 154.48,93.6 v1(153.32,93.6) ; 78.56,72.12 78.53,72.15 78.53,74.6 v1(77.38,74.6) ; v1(134.38,93.6) 135.53,93.6 135.53,91.15 135.56,91.12 ; v1(20.35,93.6) 21.5,93.6 21.5,91.15 21.53,91.12 ; v1(134.38,36.6) 135.53,36.6 135.53,34.15 135.56,34.12 ; 116.53,15.12 116.5,15.15 116.5,17.6 v1(115.35,17.6) ; LED3.3 2.58,68.67 C19.2 2.55,67.75 v2(2.4,67.6) ; 135.53,15.12 135.5,15.15 135.5,17.6 v1(134.35,17.6) ; 135.56,53.12 135.53,53.15 135.53,55.6 v1(134.38,55.6) ; v1(58.38,36.6) 59.53,36.6 59.53,34.15 59.56,34.12 ; 59.56,72.12 59.53,72.15 59.53,74.6 v1(58.38,74.6) ; v1(96.38,36.6) 97.53,36.6 97.53,34.15 97.56,34.12 ; v1(115.38,55.6) 116.53,55.6 116.53,53.15 116.56,53.12 ; v1(77.38,55.6) 78.53,55.6 78.53,53.15 78.56,53.12 ; 116.56,91.12 116.53,91.15 116.53,93.6 v1(115.38,93.6) ; 21.53,72.12 21.5,72.15 21.5,74.6 v1(20.35,74.6) ; v3(3,82.1) 1.4,83.7 C17.2 1.83,86.99 3.12,86.99 3.81,87.67 LED1.3 ; 78.56,91.12 78.53,91.15 78.53,93.6 v1(77.38,93.6)
  vias: v3(1.9,74.6) v3(2.7,74.6)
$1I33712\$1N1: length 3
  Top Layer w0.15: U40.47 8.48,51.14 R1.2
$1I33712\$1N6: length 2.8
  Top Layer w0.15: R3.2 6.81,38.17 6.7,38.06 U41.3
$1I33712\$1N17: length 2.7
  Top Layer w0.15: 9.4,85.83 9.4,85.95 8.25,87.1 USB1.A5
$1I33712\$1N18: length 14.2
  Top Layer w0.15: USB1.B5 5.25,88.92 6.77,90.44 12.01,90.44 12.4,90.05 12.4,87.57 10.4,85.57 10.4,85.53
$1I33712\$1N2773: length 3.2
  Top Layer w0.15: R2.2 8.88,50.54 U40.46
$1I33712\$1N2838: length 1.8
  Top Layer w0.15: 1.9,26.77 2.28,26.77 BOOT.2
$1I33712\$1N29010: length 2.4
  Top Layer w0.5: U43.1 3.9,84.05 4.5,84.05
$1I33712\$6N6477: length 13.6
  Bottom Layer w0.15: LED2.4 5.93,77.82 7.15,77.82 7.5,77.47 7.5,77.1 4.6,74.2 4.6,69.5 4.8,69.3 4.8,68.35 4.22,67.77 LED3.2
$1I33712\$6N6478: length 13.5
  Bottom Layer w0.15: LED4.2 4.22,58.27 4.8,58.85 4.8,62.9 7.5,65.6 7.5,68.17 7,68.67 LED3.4
$1I33712\$6N6479: length 11.4
  Bottom Layer w0.15: LED1.4 5.37,87.67 4.9,87.2 4.9,86.42 4.65,86.17 4.65,82.55 4.9,82.3 4.9,77.95 4.22,77.27 LED2.2
$1I33712\$6N6480: length 14.5
  Bottom Layer w0.15: LED5.2 4.22,48.77 4.8,49.35 4.8,56.32 7.5,59.02 7.5,59.17 7.47,59.2 7.47,59.5 7.2,59.78 6.19,59.78 LED4.4
$1I33712\$6N6482: length 22
  Bottom Layer w0.15: LED9.2 21.48,70.77 27,65.25 27,57.14 LED8.4
$1I33712\$6N6483: length 29.6
  Top Layer w0.15: v2(11.7,39) v2(16.2,39)
  Bottom Layer w0.15: v2(16.2,39) 17.4,40.2 18.2,40.2 24.6,46.6 24.6,49.11 LED8.2 ; LED6.4 7.93,40.17 9.1,39 v2(11.7,39)
$1I33712\$6N6484: length 22
  Bottom Layer w0.15: LED10.2 21.48,89.77 27,84.25 27,76.14 LED9.4
$1I33712\$6N6485: length 17.8
  Bottom Layer w0.15: LED12.4 77.4,91.12 78.3,90.23 78.44,90.23
$1I33712\$6N6486: length 26.6
  Bottom Layer w0.15: LED23.2 60.73,69.97 64.47,69.97 65.8,71.3 68.4,71.3 69.73,69.97 80.97,69.97 81.5,70.5 81.5,71.4 80.78,72.12 LED22.4
$1I33712\$6N6487: length 26.8
  Bottom Layer w0.15: LED24.2 40.63,71.22 41.28,71.87 41.28,72.46 43.92,75.09 61.75,75.09 62.1,74.75 62.1,73.23 LED23.4
$1I33712\$6N6488: length 26.8
  Bottom Layer w0.15: LED22.2 78.63,71.22 79.28,71.87 79.28,72.46 81.92,75.09 99.75,75.09 100.1,74.75 100.1,73.23 LED21.4
$1I33712\$6N6489: length 24.4
  Bottom Layer w0.15: LED24.4 42.38,72.12 44.2,70.3 44.2,65.8 38.35,59.95 38.35,54.21 40.34,52.22 LED25.2
$1I33712\$6N6490: length 17.8
  Bottom Layer w0.15: LED27.4 96.4,53.12 97.3,52.23 97.44,52.23
$1I33712\$6N6491: length 17.8
  Bottom Layer w0.15: LED28.4 115.4,53.12 116.3,52.23 116.44,52.23
$1I33712\$6N6492: length 17.8
  Bottom Layer w0.15: 78.44,52.23 78.3,52.23 77.4,53.12 LED26.4
$1I33712\$6N6493: length 17.8
  Bottom Layer w0.15: LED29.4 134.4,53.12 135.3,52.23 135.44,52.23
$1I33712\$6N6494: length 26.6
  Bottom Layer w0.15: LED32.4 156.78,34.12 157.5,33.4 157.5,32.5 156.97,31.97 145.73,31.97 144.4,33.3 141.8,33.3 140.47,31.97 136.73,31.97 LED33.2
$1I33712\$6N6495: length 26.8
  Bottom Layer w0.15: LED33.4 138.1,35.23 138.1,36.75 137.75,37.09 119.92,37.09 117.28,34.46 117.28,33.87 116.63,33.22 LED34.2
$1I33712\$6N6496: length 24.4
  Bottom Layer w0.15: LED31.4 156.38,53.12 158.2,51.3 158.2,46.8 152.35,40.95 152.35,35.21 154.34,33.22 LED32.2
$1I33712\$6N6497: length 26.6
  Bottom Layer w0.15: LED34.4 118.78,34.12 119.5,33.4 119.5,32.5 118.97,31.97 107.73,31.97 106.4,33.3 103.8,33.3 102.47,31.97 98.73,31.97 LED35.2
$1I33712\$6N6498: length 26.8
  Bottom Layer w0.15: LED37.4 62.1,35.23 62.1,36.75 61.75,37.09 43.92,37.09 41.28,34.46 41.28,33.87 40.63,33.22 LED38.2
$1I33712\$6N6499: length 24.4
  Bottom Layer w0.15: LED38.4 42.38,34.12 44.2,32.3 44.2,27.8 38.35,21.95 38.35,16.21 40.34,14.22 LED39.2
$1I33712\$6N6500: length 26.6
  Bottom Layer w0.15: LED37.2 60.73,31.97 64.47,31.97 65.8,33.3 68.4,33.3 69.73,31.97 80.97,31.97 81.5,32.5 81.5,33.4 80.78,34.12 LED36.4
$1I33712\$6N6501: length 17.8
  Bottom Layer w0.15: 59.44,14.23 59.3,14.23 58.4,15.12 LED39.4
$1I33712\$6N6502: length 17.8
  Bottom Layer w0.15: LED42.4 115.4,15.12 116.3,14.23 116.44,14.23
$1I33712\$6N6503: length 17.8
  Bottom Layer w0.15: 135.44,14.23 135.3,14.23 134.4,15.12 LED43.4
$1I33712\$6N6504: length 17.8
  Bottom Layer w0.15: LED41.4 96.4,15.12 97.3,14.23 97.44,14.23
$1I33712\$6N6505: length 17.8
  Bottom Layer w0.15: LED44.4 153.4,15.12 154.3,14.23 154.44,14.23
$1I33712\$6N6506: length 26.6
  Bottom Layer w0.15: LED18.4 156.78,72.12 157.5,71.4 157.5,70.5 156.97,69.97 145.73,69.97 144.4,71.3 141.8,71.3 140.47,69.97 136.73,69.97 LED19.2
$1I33712\$6N6507: length 17.8
  Bottom Layer w0.15: 59.44,90.23 59.3,90.23 58.4,91.12 LED11.4
$1I33712\$6N6508: length 17.8
  Bottom Layer w0.15: 116.44,90.23 116.3,90.23 115.4,91.12 LED14.4
$1I33712\$6N6509: length 17.8
  Bottom Layer w0.15: LED13.4 96.4,91.12 97.3,90.23 97.44,90.23
$1I33712\$6N6510: length 26.8
  Bottom Layer w0.15: LED19.4 138.1,73.23 138.1,74.75 137.75,75.09 119.92,75.09 117.28,72.46 117.28,71.87 116.63,71.22 LED20.2
$1I33712\$6N6511: length 24.4
  Bottom Layer w0.15: LED17.4 156.38,91.12 158.2,89.3 158.2,84.8 152.35,78.95 152.35,73.21 154.34,71.22 LED18.2
$1I33712\$6N6512: length 17.8
  Bottom Layer w0.15: 154.44,90.23 154.3,90.23 153.4,91.12 LED16.4
$1I33712\$6N6513: length 3.2
  Top Layer w0.15: R9.1 1.76,87.08 1.76,87.08 1.92,86.92 2.88,86.92 v2(3.3,86.5)
  Bottom Layer w0.15: v2(3.3,86.5) 3.58,86.77 LED1.2
$1I33712\$6N6516: length 12.2
  Bottom Layer w0.15: LED5.4 5.83,49.67 6.3,49.2 6.3,46.5 4.42,44.62 4.42,41.7 4.8,41.33 4.8,39.85 4.37,39.42 4.23,39.42 LED6.2
$1I33712\$6N6517: length 17.8
  Bottom Layer w0.15: 40.44,90.23 40.3,90.23 39.4,91.12 LED10.4
$1I33712\$6N6518: length 17.8
  Bottom Layer w0.15: LED15.4 134.4,91.12 135.3,90.23 135.44,90.23
$1I33712\$6N6519: length 26.6
  Bottom Layer w0.15: LED21.2 98.73,69.97 102.47,69.97 103.8,71.3 106.4,71.3 107.73,69.97 118.97,69.97 119.5,70.5 119.5,71.4 118.78,72.12 LED20.4
$1I33712\$6N6520: length 17.8
  Bottom Layer w0.15: 59.44,52.23 59.3,52.23 58.4,53.12 LED25.4
$1I33712\$6N6521: length 17.8
  Bottom Layer w0.15: LED30.4 153.4,53.12 154.3,52.23 154.44,52.23
$1I33712\$6N6522: length 26.8
  Bottom Layer w0.15: LED35.4 100.1,35.23 100.1,36.75 99.75,37.09 81.92,37.09 79.28,34.46 79.28,33.87 78.63,33.22 LED36.2
$1I33712\$6N6523: length 17.8
  Bottom Layer w0.15: 78.44,14.23 78.3,14.23 77.4,15.12 LED40.4
$1I33712\$7N3321: length 3.6
  Top Layer w0.15: U1.1 148.1,83.4 D1.2
$1I33712\$7N3322: length 3.6
  Top Layer w0.15: U3.1 148.1,45.4 D3.2
$1I33712\$7N3323: length 3.6
  Top Layer w0.15: U4.1 148.1,26.4 D4.2
$1I33712\$7N3324: length 3.6
  Top Layer w0.15: U5.1 148.1,7.4 D5.2
$1I33712\$7N3325: length 3.6
  Top Layer w0.15: D6.2 129.1,83.4 U6.1
$1I33712\$7N3326: length 3.6
  Top Layer w0.15: D7.2 129.1,64.4 U7.1
$1I33712\$7N3327: length 3.6
  Top Layer w0.15: U8.1 129.1,45.4 D8.2
$1I33712\$7N3328: length 3.6
  Top Layer w0.15: D9.2 129.1,26.4 U9.1
$1I33712\$7N3329: length 3.6
  Top Layer w0.15: D10.2 129.1,7.4 U10.1
$1I33712\$7N3330: length 3.6
  Top Layer w0.15: D11.2 110.1,83.4 U11.1
$1I33712\$7N3331: length 3.6
  Top Layer w0.15: U12.1 110.1,64.4 D12.2
$1I33712\$7N3332: length 3.6
  Top Layer w0.15: D13.2 110.1,45.4 U13.1
$1I33712\$7N3333: length 3.6
  Top Layer w0.15: D14.2 110.1,26.4 U14.1
$1I33712\$7N3334: length 3.6
  Top Layer w0.15: D15.2 110.1,7.4 U15.1
$1I33712\$7N3335: length 3.6
  Top Layer w0.15: U16.1 91.1,83.4 D16.2
$1I33712\$7N3336: length 3.6
  Top Layer w0.15: D17.2 91.1,64.4 U17.1
$1I33712\$7N3337: length 3.6
  Top Layer w0.15: U18.1 91.1,45.4 D18.2
$1I33712\$7N3338: length 3.6
  Top Layer w0.15: D19.2 91.1,26.4 U19.1
$1I33712\$7N3339: length 3.6
  Top Layer w0.15: U20.1 91.1,7.4 D20.2
$1I33712\$7N3340: length 3.6
  Top Layer w0.15: D21.2 72.1,83.4 U21.1
$1I33712\$7N3341: length 3.6
  Top Layer w0.15: U22.1 72.1,64.4 D22.2
$1I33712\$7N3342: length 3.6
  Top Layer w0.15: D23.2 72.1,45.4 U23.1
$1I33712\$7N3343: length 3.6
  Top Layer w0.15: D24.2 72.1,26.4 U24.1
$1I33712\$7N3344: length 3.6
  Top Layer w0.15: U25.1 72.1,7.4 D25.2
$1I33712\$7N3345: length 3.6
  Top Layer w0.15: D26.2 53.1,83.4 U26.1
$1I33712\$7N3346: length 3.6
  Top Layer w0.15: D27.2 53.1,64.4 U27.1
$1I33712\$7N3347: length 3.6
  Top Layer w0.15: D28.2 53.1,45.4 U28.1
$1I33712\$7N3348: length 3.6
  Top Layer w0.15: D29.2 53.1,26.4 U29.1
$1I33712\$7N3349: length 3.6
  Top Layer w0.15: U30.1 53.1,7.4 D30.2
$1I33712\$7N3350: length 3.5
  Top Layer w0.15: 34.2,83.49 34.1,83.59 D31.2 ; 34.1,83.4 U31.1
$1I33712\$7N3351: length 3.6
  Top Layer w0.15: U32.1 34.1,64.4 D32.2
$1I33712\$7N3352: length 3.6
  Top Layer w0.15: D33.2 34.1,45.4 U33.1
$1I33712\$7N3353: length 3.6
  Top Layer w0.15: D34.2 34.1,26.4 U34.1
$1I33712\$7N3354: length 3.6
  Top Layer w0.15: U35.1 34.1,7.4 D35.2
$1I33712\$7N3355: length 3.6
  Top Layer w0.15: U36.1 15.1,83.4 D36.2
$1I33712\$7N3356: length 3.6
  Top Layer w0.15: D37.2 15.1,64.4 U37.1
$1I33712\$7N3357: length 3.6
  Top Layer w0.15: U38.1 15.1,45.4 D38.2
$1I33712\$7N3358: length 1.7
  Bottom Layer w0.15: D39.2 SW8.1
$1I33712\$7N3359: length 1.8
  Bottom Layer w0.15: D41.2 6.03,90.8 SW3.1
$1I33712\$7N3360: length 1.7
  Bottom Layer w0.15: D42.2 SW4.1
$1I33712\$7N3361: length 1.7
  Bottom Layer w0.15: D43.2 SW5.1
$1I33712\$7N3362: length 1.7
  Bottom Layer w0.15: D44.2 SW6.1
$1I33712\$7N3363: length 1.7
  Bottom Layer w0.15: D45.2 SW7.1
$1I33712\$7N3393: length 3.6
  Top Layer w0.15: D2.2 148.1,64.4 U2.1
$1I33712\COL1: length 272.7
  Top Layer w0.15: v2(1.1,47.4) 2.16,46.34 U40.4 ; U5.2 162.2,5.61 162.2,22.66 U4.2 162.2,24.61 162.2,41.66 U3.2 162.2,43.61 162.2,60.66 U2.2 ; U2.2 159,59.3 v2(15,59.3) ; U2.2 162.2,62.61 162.2,79.66 U1.2
  Inner2 w0.15: v2(1.1,47.4) 3.4,45.1 3.4,37.37 4.34,36.43 10.92,36.43 13.6,39.1 13.6,57.9 v2(15,59.3)
$1I33712\COL2: length 253.1
  Top Layer w0.15: U6.2 143.2,79.76 v2(143.2,70.7) ; v2(15.5,58.8) 15.7,59 143,59 v2(143.2,58.8) v2(143.2,51.7) ; U10.2 143.2,5.5 v2(143.2,12.3) ; v2(1.1,46.7) 1.86,45.94 U40.5 ; v2(143.2,59.8) 143.2,60.76 U7.2 143.2,62.51 v2(143.2,69.3) ; v2(143.2,13.7) 143.2,22.75 U9.2 143.2,24.5 v2(143.2,31.3) ; v2(143.2,50.3) 143.2,43.51 U8.2 143.2,41.76 v2(143.2,32.7)
  Inner2 w0.15: v2(15.5,58.8) 13.9,57.2 13.9,38.98 11.05,36.12 4.22,36.12 3.1,37.25 3.1,44.7 v2(1.1,46.7)
  Bottom Layer w0.15: v2(143.2,69.3) v2(143.2,70.7) ; v2(143.2,50.3) v2(143.2,51.7) ; v2(143.2,58.8) v2(143.2,59.8) ; v2(143.2,12.3) v2(143.2,13.7) ; v2(143.2,31.3) v2(143.2,32.7)
$1I33712\COL3: length 233.3
  Top Layer w0.15: v2(16,58.3) 16.4,58.7 124,58.7 v2(124.2,58.5) v2(124.2,51.7) ; v2(124.2,13.7) 124.2,22.75 U14.2 124.2,24.5 v2(124.2,31.3) ; v2(124.2,69.3) 124.2,62.51 U12.2 124.2,60.76 v2(124.2,59.8) ; U40.6 1.56,45.54 v2(1.1,46) ; U15.2 124.2,5.5 v2(124.2,12.3) ; v2(124.2,50.3) 124.2,43.51 U13.2 124.2,41.76 v2(124.2,32.7) ; U11.2 124.2,79.76 v2(124.2,70.7)
  Inner2 w0.15: v2(1.1,46) 2.8,44.3 2.8,37.12 4.1,35.83 11.17,35.83 14.2,38.85 14.2,56.5 v2(16,58.3)
  Bottom Layer w0.15: v2(124.2,12.3) v2(124.2,13.7) ; v2(124.2,31.3) v2(124.2,32.7) ; v2(124.2,50.3) v2(124.2,51.7) ; v2(124.2,69.3) v2(124.2,70.7) ; v2(124.2,58.5) v2(124.2,59.8)
$1I33712\COL4: length 213.5
  Top Layer w0.15: v2(105.2,32.7) 105.2,41.76 U18.2 105.2,43.51 v2(105.2,50.3) ; U40.7 1.26,45.14 v2(1.1,45.3) ; U16.2 105.2,79.76 v2(105.2,70.7) ; U20.2 105.2,5.5 v2(105.2,12.3) ; v2(105.2,13.7) 105.2,22.75 U19.2 105.2,24.5 v2(105.2,31.3) ; v2(105.2,69.3) 105.2,62.51 U17.2 105.2,60.76 v2(105.2,59.8) ; v2(105.2,51.7) v2(105.2,58.2) 105,58.4 17.1,58.4 v2(16.5,57.8)
  Inner2 w0.15: v2(1.1,45.3) 2.5,43.9 2.5,37 3.97,35.53 11.3,35.53 14.5,38.73 14.5,55.8 v2(16.5,57.8)
  Bottom Layer w0.15: v2(105.2,69.3) v2(105.2,70.7) ; v2(105.2,12.3) v2(105.2,13.7) ; v2(105.2,58.2) v2(105.2,59.8) ; v2(105.2,31.3) v2(105.2,32.7) ; v2(105.2,50.3) v2(105.2,51.7)
$1I33712\COL5: length 193.9
  Top Layer w0.15: v2(86.2,51.7) v2(86.2,57.9) 86,58.1 17.8,58.1 v2(17,57.3) ; U21.2 86.2,79.76 v2(86.2,70.7) ; U40.8 3.9,44.72 1.22,44.72 v2(1.1,44.6) ; v2(86.2,69.3) 86.2,62.51 U22.2 86.2,60.76 v2(86.2,59.8) ; v2(86.2,50.3) 86.2,43.51 U23.2 86.2,41.76 v2(86.2,32.7) ; v2(86.2,12.3) 86.2,5.5 U25.2 ; v2(86.2,31.3) 86.2,24.5 U24.2 86.2,22.75 v2(86.2,13.7)
  Inner2 w0.15: v2(17,57.3) 14.8,55.1 14.8,38.6 11.42,35.23 3.85,35.23 2.2,36.87 2.2,43.5 v2(1.1,44.6)
  Bottom Layer w0.15: v2(86.2,32.7) v2(86.2,31.3) ; v2(86.2,13.7) v2(86.2,12.3) ; v2(86.2,51.7) v2(86.2,50.3) ; v2(86.2,57.9) v2(86.2,59.8) ; v2(86.2,70.7) v2(86.2,69.3)
$1I33712\COL6: length 173.5
  Top Layer w0.15: v2(67.2,69.3) 67.2,62.51 U27.2 67.2,60.76 v2(67.2,59.8) ; v2(1.7,42.2) 1.7,43.8 2.24,44.34 U40.9 ; v2(17.5,56.8) 17.5,56.9 18.4,57.8 67,57.8 v2(67.2,57.6) v2(67.2,51.7) ; v2(67.2,70.7) 67.2,79.76 U26.2 ; v2(67.2,31.3) 67.2,24.5 U29.2 67.2,22.75 v2(67.2,13.7) ; v2(67.2,32.7) 67.2,41.76 U28.2 67.2,43.51 v2(67.2,50.3) ; U30.2 67.2,5.5 v2(67.2,12.3)
  Inner2 w0.15: v2(17.5,56.8) 15.1,54.4 15.1,38.48 11.55,34.93 3.72,34.93 1.9,36.75 1.9,42 v2(1.7,42.2)
  Bottom Layer w0.15: v2(67.2,31.3) v2(67.2,32.7) ; v2(67.2,57.6) v2(67.2,59.8) ; v2(67.2,69.3) v2(67.2,70.7) ; v2(67.2,50.3) v2(67.2,51.7) ; v2(67.2,12.3) v2(67.2,13.7)
$1I33712\COL7: length 154.6
  Top Layer w0.15: U35.2 48.2,5.5 v2(48.2,12.3) ; U40.15 4.39,40.9 2,40.9 v2(1.1,41.8) ; v2(48.2,59.8) 48.2,60.76 U32.2 48.2,62.51 v2(48.2,69.3) ; v2(48.2,51.7) v2(48.2,57.3) 48,57.5 19.2,57.5 v2(18,56.3) ; v2(48.2,32.7) 48.2,41.76 U33.2 48.2,43.51 v2(48.2,50.3) ; v2(48.2,31.3) 48.2,24.5 U34.2 48.2,22.75 v2(48.2,13.7) ; U31.2 48.2,79.76 v2(48.2,70.7)
  Inner2 w0.15: v2(18,56.3) 15.4,53.7 15.4,38.35 11.67,34.62 3.6,34.62 1.6,36.62 1.6,41.3 v2(1.1,41.8)
  Bottom Layer w0.15: v2(48.2,69.3) v2(48.2,70.7) ; v2(48.2,50.3) v2(48.2,51.7) ; v2(48.2,31.3) v2(48.2,32.7) ; v2(48.2,57.3) v2(48.2,59.8) ; v2(48.2,12.3) v2(48.2,13.7)
$1I33712\COL8: length 99
  Top Layer w0.15: U40.16 5.28,40.82 5.06,40.6 1.6,40.6 v2(1.1,41.1) ; 29.2,43.51 U38.2 ; 29.2,43.51 v2(29.2,50.27) ; 29.2,43.51 29.2,43.48 ; 29.2,51.7 v2(29.2,57) 29,57.2 19.9,57.2 v2(18.5,55.8) ; v2(29.2,70.6) 29.2,79.76 U36.2 ; v2(29.2,69.2) 29.2,62.51 U37.2 29.2,60.76 v2(29.2,59.8)
  Inner2 w0.15: v2(18.5,55.8) 15.7,53 15.7,38.23 11.8,34.33 3.47,34.33 1.1,36.7 v2(1.1,41.1)
  Bottom Layer w0.15: v2(29.2,70.6) v2(29.2,69.2) ; v2(29.2,57) v2(29.2,59.8) ; SW8.2 0.6,42.29 0.6,41.6 v2(1.1,41.1) ; v2(29.2,51.67) v2(29.2,50.27)
$1I33712\COL9: length 76.3
  Top Layer w0.15: U40.36 11.84,45.14 v2(12,45.3)
  Inner2 w0.15: v2(1.1,48.1) 3.8,45.4 3.8,42.27 4.38,41.7 4.38,41.3 3.7,40.63 3.7,37.5 4.47,36.73 10.8,36.73 12.47,38.4 12.47,44.83 v2(12,45.3)
  Bottom Layer w0.15: v2(1.1,48.1) 0.72,48.48 0.72,51.91 SW7.2 0.72,53.69 0.72,61.41 SW6.2 0.83,63.08 0.83,71.02 SW5.2 0.83,72.58 0.83,80.52 SW4.2 0.6,82.32 0.6,89.83 1.52,90.75 SW3.2
$1I33712\DI: length 41.9
  Top Layer w0.15: 1.4,86.57 0.6,85.77 ; 0.6,85.77 0.6,49.4 3.26,46.74 U40.3 ; 0.6,85.77 0.6,85.77
$1I33712\GND: length 134.5
  Top Layer w0.15: C13.1 v2(12.7,45.3) ; v2(12.1,48.5) 12.45,48.86 C12.1 ; v2(6,38.6) 6,37.67 4.68,36.35 U41.4 ; v2(6,38.6) 6.55,39.15 6.7,39.15 ; v2(6,38.6) 5.45,39.15 C1.2 ; 2.5,50.34 v1(2.5,51.3) ; R7.1 R8.1 ; C11.1 C8.2 ; C8.2 C7.1 ; C8.2 v1(11.7,53.7) ; U42.4 5.75,56.2 v1(5.76,56.19) ; v1(3.9,41.5) 3.39,42.01 2.94,42.01 2.5,42.46 ; U43.2 2,86 v1(2.3,86.3) ; C9.1 6.7,53.2 v1(7.2,53.7) ; C9.1 C10.1 ; C9.1 C5.1 ; U41.2 8.5,36.45 v1(8.5,37.2) 8.7,37.4 C14.1 C6.1 ; v1(7,42.4) 6.92,42.4 6.48,41.96 U40.19
  Top Layer w0.3: v1(5.7,46.8) 7.48,45.02 U40.57 ; U40.57 7.5,44.96 ; U40.57 7.44,44.9 v1(5.6,44.9) ; U40.57 9.26,44.94 v1(9.3,44.9) ; 7.5,44.91 7,44.41 v1(7,42.4) ; v2(3.13,67.6) 3.13,68.2 U39.1 ; C3.1 3,61.4 v2(2.7,61.1) ; v2(7.7,63.2) 8.1,62.8 C4.1 ; 7.5,44.96 9.3,46.76 v1(9.3,46.8) ; 7.5,44.96 v1(7.5,46.8)
  Top Layer w0.35: U43.5 v3(2,84.2) U43.2
  Top Layer w0.5: USB1.2 3.25,88.04 USB1.B1A12 ; D46.3 v1(7,83.12) ; USB1.1 10.75,88.04 USB1.A1B12
  Top Layer w0.75: v3(7.2,72.7) CN1.3 v3(9.6,72.7) ; v3(9.4,79.9) CN1.3 v3(7.2,79.9)
  Inner2 w0.15: v1(23.75,52.1) 23,51.35 23,51.3
  Bottom Layer w0.15: 23.03,90.22 23.16,90.1 v1(23.75,90.1) ; v1(137.57,74.6) 136.62,74.6 ; LED4.1 5.97,58.27 v1(7,59.3) ; v1(80.55,17.6) 79.59,17.6 ; v1(137.57,55.6) 136.62,55.6 ; v1(42.55,17.6) 41.59,17.6 ; LED2.1 6.97,77.27 v1(7,77.3) ; 80.06,90.22 80.18,90.1 v1(80.78,90.1) ; 23.03,71.22 23.16,71.1 v1(23.75,71.1) ; v1(61.57,93.6) 60.62,93.6 ; 61.06,52.22 61.18,52.1 v1(61.78,52.1) ; 118.06,52.22 118.18,52.1 v1(118.78,52.1) ; 23.03,52.22 23.16,52.1 v1(23.75,52.1) ; v1(156.53,36.6) 155.57,36.6 ; 42.06,90.22 42.18,90.1 v1(42.78,90.1) ; 61.06,71.22 61.18,71.1 v1(61.78,71.1) ; v1(23.55,55.6) 22.59,55.6 ; v1(137.75,14.1) 137.16,14.1 137.03,14.22 ; C18.1 1.45,77.97 v2(1.83,77.6) ; v1(118.57,93.6) 117.62,93.6 ; v1(80.78,52.1) 80.18,52.1 80.06,52.22 ; v1(137.78,33.1) 137.18,33.1 137.06,33.22 ; 61.03,14.22 61.16,14.1 v1(61.75,14.1) ; v1(80.75,14.1) 80.16,14.1 80.03,14.22 ; 99.06,33.22 99.18,33.1 v1(99.78,33.1) ; v1(156.72,71.1) 156.13,71.1 156.01,71.22 ; v1(156.7,14.1) 156.1,14.1 LED45.1 ; v1(156.5,17.6) C24.1 ; v1(23.55,74.6) 22.59,74.6 ; v1(137.57,36.6) 136.62,36.6 ; v1(156.53,55.6) 155.57,55.6 ; 156.01,52.22 156.23,52 v1(156.8,52) ; 61.06,33.22 61.18,33.1 v1(61.78,33.1) ; v1(99.75,14.1) 99.16,14.1 99.03,14.22 ; v1(118.78,71.1) 118.18,71.1 118.06,71.22 ; v1(118.75,14.1) 118.16,14.1 118.03,14.22 ; v1(99.57,36.6) 98.62,36.6 ; v1(42.58,36.6) 41.62,36.6 ; 99.06,90.22 99.18,90.1 v1(99.78,90.1) ; v1(156.53,93.6) 155.57,93.6 ; v1(137.78,52.1) 137.18,52.1 137.06,52.22 ; LED5.1 5.7,48.65 v1(5.7,46.8) ; 99.06,52.22 99.18,52.1 v1(99.78,52.1) ; v1(80.57,74.6) 79.62,74.6 ; v1(42.58,55.6) 41.62,55.6 ; v1(137.57,93.6) 136.62,93.6 ; v1(137.78,71.1) 137.18,71.1 137.06,71.22 ; v1(42.8,33) 42.28,33 42.06,33.22 ; v1(99.78,71.1) 99.18,71.1 99.06,71.22 ; v1(5.12,84.7) 5.85,85.42 5.85,86.62 5.7,86.77 LED1.1 ; v1(99.57,74.6) 98.62,74.6 ; v1(42.75,14.1) 42.16,14.1 42.03,14.22 ; 137.06,90.22 137.18,90.1 v1(137.78,90.1) ; v1(42.8,71) 42.28,71 42.06,71.22 ; v1(99.55,17.6) 98.59,17.6 ; C17.1 1.71,87.65 USB1.2 ; v1(80.57,93.6) 79.62,93.6 ; v1(61.57,55.6) 60.62,55.6 ; 156.01,33.22 156.13,33.1 v1(156.72,33.1) ; v1(118.57,55.6) 117.62,55.6 ; v1(118.57,74.6) 117.62,74.6 ; v1(118.78,90.1) 118.18,90.1 118.06,90.22 ; 80.06,33.22 80.18,33.1 v1(80.78,33.1) ; 61.06,90.22 61.18,90.1 v1(61.78,90.1) ; v1(1.2,61.1) 1.2,59.46 C20.1 ; v1(137.55,17.6) 136.59,17.6 ; 42.06,52.22 42.18,52.1 v1(42.78,52.1) ; 118.06,33.22 118.18,33.1 v1(118.78,33.1) ; v1(99.57,93.6) 98.62,93.6 ; 80.06,71.22 80.18,71.1 v1(80.78,71.1) ; v1(42.58,93.6) 41.62,93.6 ; v1(42.58,74.6) 41.62,74.6 ; v1(99.57,55.6) 98.62,55.6 ; v1(61.57,36.6) 60.62,36.6 ; 156.01,90.22 156.23,90 156.72,90 ; v1(61.55,17.6) 60.59,17.6 ; v1(7,67.8) 6.97,67.77 LED3.1 ; v1(118.55,17.6) 117.59,17.6 ; v1(23.55,93.6) 22.59,93.6 ; v1(80.57,55.6) 79.62,55.6 ; v1(156.53,74.6) 155.57,74.6 ; v1(61.57,74.6) 60.62,74.6 ; v1(80.57,36.6) 79.62,36.6 ; v1(118.57,36.6) 117.62,36.6
  vias: v1(1.1,35.9) v1(1.2,51.6) v1(1.3,54.6) v1(1.9,30.9) v1(2.3,70.7) v1(2.5,54.6) v1(3.1,90.1) v1(3.2,65) v1(4.2,81.5) v1(4.2,55.4) v1(4.3,30.9) v1(4.6,74.9) v1(5.1,70) v1(5.5,60.7) v1(7.9,85) v1(8.97,27.8) v1(9.5,59.45) v1(9.5,58.15) v1(9.5,56.85) v1(10.1,55.4) v1(10.5,60.8) v1(11,39.9) v1(11.6,70.5) v1(11.6,66.1) v1(11.6,38.2) v1(11.6,33.8) v1(11.9,73.9) v1(11.9,60.8) v1(11.9,55.4) v1(12.1,86.6) v1(13,88.9) v1(13.2,70) v1(13.9,60.6) v1(14.1,35.9) v1(14.2,85.5) v1(14.2,81.1) v1(14.3,66.1) v1(15,60) v1(15.9,37.7) v1(16.5,51.7) v1(16.5,27.8) v1(16.6,43.1) v1(17.6,39.7) v1(19,55.3) v1(19.2,85.5) v1(19.2,66.5) v1(19.2,47.5) v1(20.3,92.3) v1(20.6,52.8) v1(21.2,27.8) v1(25.3,48.6) v1(26.4,63.6) v1(26.4,59.8) v1(26.9,37.9) v1(28.4,82.5) v1(28.4,78.7) v1(28.4,70.6) v1(28.4,69.2) v1(28.4,63.6) v1(28.4,56.5) v1(28.4,51.67) v1(28.4,50.27) v1(28.4,44.5) v1(30,78.7) v1(30,70.6) v1(30,69.2) v1(30,56.5) v1(30,51.67) v1(30,50.27) v1(30.1,89.7) v1(30.1,88.4) v1(30.8,32.7) v1(30.8,26.2) v1(32.9,31.3) v1(32.9,28) v1(32.9,24.3) v1(32.9,14.9) v1(32.9,13.2) v1(32.9,9.5) v1(34.2,2.7) v1(38.18,85.51) v1(38.2,66.5) v1(38.2,47.5) v1(38.2,28.5) v1(38.2,9.5) v1(39.4,92.3) v1(39.4,56.8) v1(39.4,18.8) v1(42.8,72.9) v1(42.8,34.9) v1(47.38,89.71) v1(47.4,88.4) v1(47.38,82.61) v1(47.4,78.7) v1(47.4,70.7) v1(47.4,69.3) v1(47.4,63.6) v1(47.4,56.8) v1(47.4,51.7) v1(47.4,50.3) v1(47.4,44.6) v1(47.4,40.7) v1(47.4,32.7) v1(47.4,31.3) v1(47.4,25.6) v1(47.4,21.7) v1(47.4,13.7) v1(47.4,12.3) v1(47.4,6.6) v1(49,78.7) v1(49,70.7) v1(49,69.3) v1(49,60.7) v1(49,56.8) v1(49,51.7) v1(49,50.3) v1(49,32.7) v1(49,31.3) v1(49,13.7) v1(49,12.3) v1(49,2.7) v1(57.18,85.51) v1(57.2,66.5) v1(57.2,47.5) v1(57.2,28.5) v1(57.2,9.5) v1(58.4,92.3) v1(66.38,82.61) v1(66.4,78.7) v1(66.4,70.7) v1(66.4,69.3) v1(66.4,63.6) v1(66.4,57.1) v1(66.4,51.7) v1(66.4,50.3) v1(66.4,44.6) v1(66.4,40.7) v1(66.4,32.7) v1(66.4,31.3) v1(66.4,25.6) v1(66.4,21.7) v1(66.4,13.7) v1(66.4,12.3) v1(66.4,6.6) v1(67.98,89.71) v1(67.98,88.31) v1(67.98,78.71) v1(68,70.7) v1(68,69.3) v1(68,60.7) v1(68,57.1) v1(68,51.7) v1(68,50.3) v1(68,40.7) v1(68,32.7) v1(68,31.3) v1(68,21.7) v1(68,13.7) v1(68,12.3) v1(68,2.7) v1(76.18,85.51) v1(76.2,66.5) v1(76.2,47.5) v1(76.2,28.5) v1(76.2,9.5) v1(77.4,92.3) v1(80.8,72.9) v1(80.8,34.9) v1(85.38,82.61) v1(85.4,70.7) v1(85.4,69.3) v1(85.4,63.6) v1(85.4,57.4) v1(85.4,51.7) v1(85.4,50.3) v1(85.4,44.6) v1(85.4,32.7) v1(85.4,31.3) v1(85.4,25.6) v1(85.4,13.7) v1(85.4,12.3) v1(85.4,6.6) v1(85.5,78.7) v1(85.5,40.7) v1(85.5,21.7) v1(86.98,89.71) v1(86.98,88.31) v1(86.98,78.71) v1(87,70.7) v1(87,69.3) v1(87,60.7) v1(87,57.4) v1(87,51.7) v1(87,50.3) v1(87,40.7) v1(87,32.7) v1(87,31.3) v1(87,21.7) v1(87,13.7) v1(87,12.3) v1(87,2.7) v1(95.18,85.51) v1(95.2,66.5) v1(95.2,47.5) v1(95.2,28.5) v1(95.2,9.5) v1(96.4,92.3) v1(104.38,82.61) v1(104.4,70.7) v1(104.4,69.3) v1(104.4,63.6) v1(104.4,57.7) v1(104.4,51.7) v1(104.4,50.3) v1(104.4,44.6) v1(104.4,32.7) v1(104.4,31.3) v1(104.4,25.6) v1(104.4,13.7) v1(104.4,12.3) v1(104.4,6.6) v1(104.5,78.7) v1(104.5,40.7) v1(104.5,21.7) v1(105.98,89.71) v1(105.98,88.31) v1(105.98,78.71) v1(106,70.7) v1(106,69.3) v1(106,60.7) v1(106,57.7) v1(106,51.7) v1(106,50.3) v1(106,40.7) v1(106,32.7) v1(106,31.3) v1(106,21.7) v1(106,13.7) v1(106,12.3) v1(106,2.7) v1(114.18,85.51) v1(114.2,66.5) v1(114.2,47.5) v1(114.2,28.5) v1(114.2,9.5) v1(115.4,92.3) v1(118.8,72.9) v1(118.8,34.9) v1(123.38,82.61) v1(123.4,78.7) v1(123.4,70.7) v1(123.4,69.3) v1(123.4,63.6) v1(123.4,58) v1(123.4,51.7) v1(123.4,50.3) v1(123.4,44.6) v1(123.4,40.7) v1(123.4,32.7) v1(123.4,31.3) v1(123.4,25.6) v1(123.4,21.7) v1(123.4,13.7) v1(123.4,12.3) v1(123.4,6.6) v1(124.98,89.71) v1(124.98,88.31) v1(124.98,78.71) v1(125,70.7) v1(125,69.3) v1(125,60.7) v1(125,58) v1(125,51.7) v1(125,50.3) v1(125,40.7) v1(125,32.7) v1(125,31.3) v1(125,21.7) v1(125,13.7) v1(125,12.3) v1(125,2.7) v1(133.18,85.51) v1(133.2,66.5) v1(133.2,47.5) v1(133.2,28.5) v1(133.2,9.5) v1(134.4,92.3) v1(142.38,82.61) v1(142.4,78.7) v1(142.4,70.7) v1(142.4,69.3) v1(142.4,63.6) v1(142.4,58.3) v1(142.4,51.7) v1(142.4,50.3) v1(142.4,44.6) v1(142.4,40.7) v1(142.4,32.7) v1(142.4,31.3) v1(142.4,25.6) v1(142.4,21.7) v1(142.4,13.7) v1(142.4,12.3) v1(142.4,6.6) v1(143.98,89.71) v1(143.98,88.31) v1(143.98,78.71) v1(144,70.7) v1(144,69.3) v1(144,60.7) v1(144,58.3) v1(144,51.7) v1(144,50.3) v1(144,40.7) v1(144,32.7) v1(144,31.3) v1(144,21.7) v1(144,13.7) v1(144,12.3) v1(144,2.7) v1(152.18,85.51) v1(152.2,66.5) v1(152.2,47.5) v1(152.2,28.5) v1(152.2,9.5) v1(153.3,92.3) v1(153.3,75.8) v1(153.3,70.7) v1(153.3,37.8) v1(156.8,90) v1(161.38,82.61) v1(161.4,78.7) v1(161.4,63.6) v1(161.4,59.6) v1(161.4,44.6) v1(161.4,40.7) v1(161.4,25.6) v1(161.4,21.7) v1(161.4,6.6) v1(162.98,89.71) v1(162.98,78.71) v1(163,70.7) v1(163,59.6) v1(163,51.7) v1(163,40.7) v1(163,32.7) v1(163,21.7) v1(163,13.7) v1(163,2.7) v2(0.85,27.8) v2(3.1,29.6) v2(3.1,26.5) v2(30.8,43.2)
$1I33712\JOY_B: length 36.2
  Top Layer w0.15: U40.41 11.59,47.14 12.1,47.64 v2(12.1,47.7) ; v2(13.3,32) 13.25,31.95 FPC3.3
  Inner2 w0.15: v2(9.2,37.2) 9.71,37.71 9.71,40.89 10.8,41.98 10.8,46.02 11.58,46.81 11.58,46.96 11.62,47.01 11.62,47.1 12.1,47.57 v2(12.1,47.7)
  Bottom Layer w0.15: v2(9.2,37.2) 12.22,34.18 12.22,32.3 12.53,32 v2(13.3,32) 21,32 24.6,28.4 H1.2
$1I33712\JOY_X: length 42.6
  Top Layer w0.15: v2(12.7,32.5) 12.75,32.45 FPC3.2 ; FPC2.1 FPC2.5 18.25,32.43 v2(18.2,32.48) ; U40.40 11.94,46.74 v2(12.1,46.9)
  Inner2 w0.15: v2(9.9,37.2) 10.01,37.31 10.01,40.76 11.1,41.85 11.1,45.9 v2(12.1,46.9)
  Bottom Layer w0.15: H1.3 26.6,28.4 22.53,32.48 v2(18.2,32.48) 12.72,32.48 v2(12.7,32.5) 12.7,34.4 v2(9.9,37.2)
$1I33712\JOY_Y: length 43
  Top Layer w0.15: v2(12.1,46.1) 11.86,46.34 U40.39 ; v2(14.8,32.98) 14.75,32.93 FPC3.6 ; v2(19.3,33) 19.25,32.95 FPC2.7 FPC2.3
  Inner2 w0.15: v2(12.1,46.1) 11.4,45.4 11.4,41.73 10.34,40.66 10.34,37.46 v2(10.6,37.2)
  Bottom Layer w0.15: v2(10.6,37.2) 14.8,33 v2(14.8,32.98) 19.28,32.98 v2(19.3,33) 24,33 28.6,28.4 H1.4
